# Altium project Ad-Flier.PrjPcb
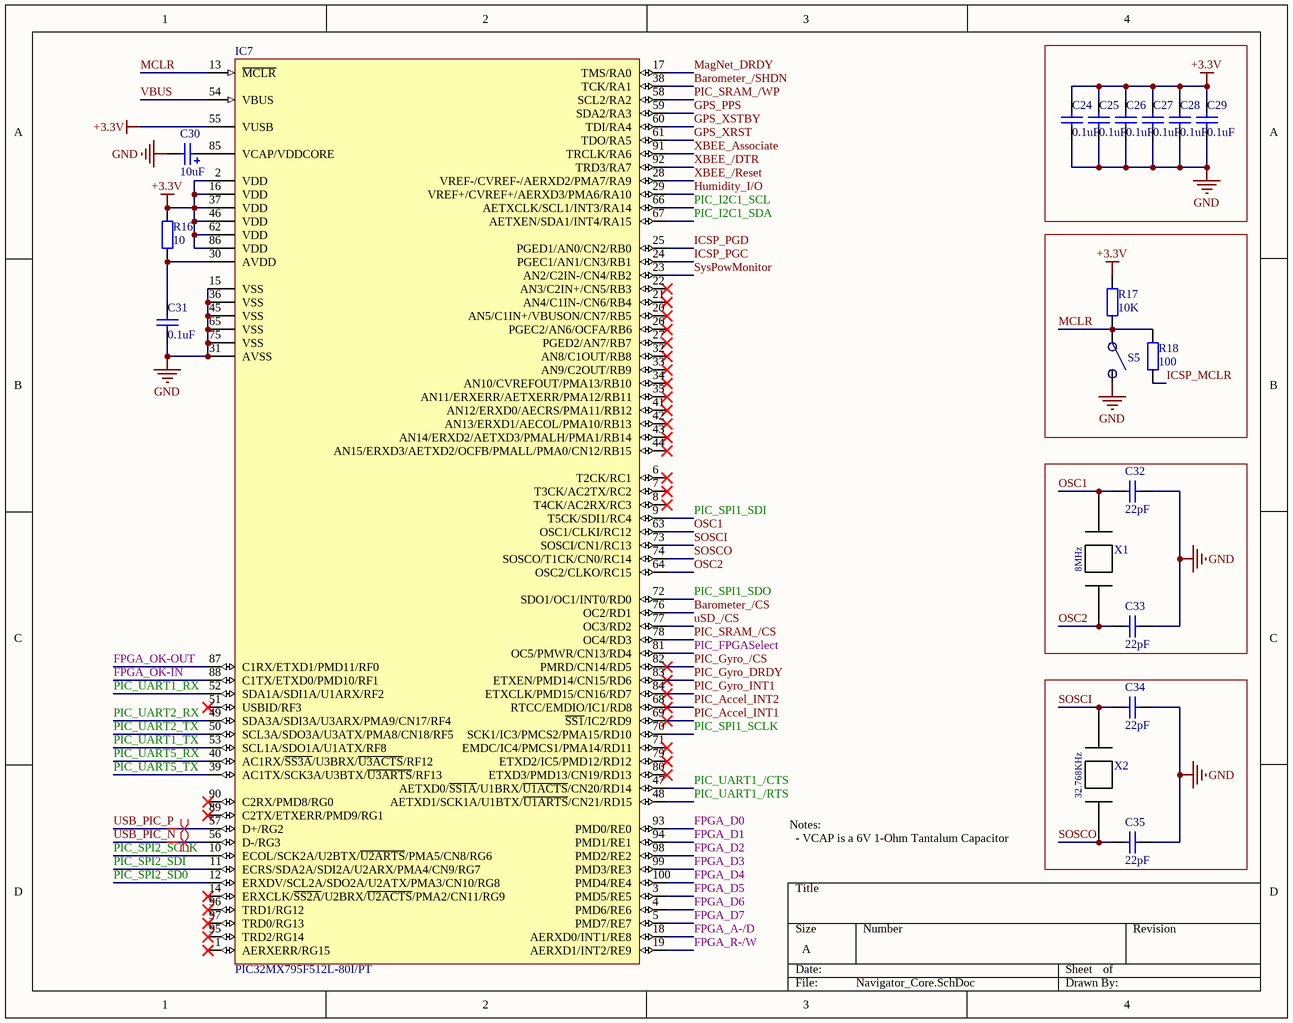
[diagram p0: Navigator_Core.SchDoc]
7 sheets, 156 parts. Net scope: global (net labels, ports and power ports of the same name join across sheets).
Board files: FlightController_Top_5x5.PcbDoc, FlightController_Top_6x6.PcbDoc
Sheets:
  Navigator_Core.SchDoc
  Navigator_Connectors.SchDoc
  Navigator_Components.SchDoc
  FPGA_Core.SchDoc
  FPGA_Clocks.SchDoc
  FPGA_Components.SchDoc
  Power.SchDoc

## Sheet Navigator_Core.SchDoc: The Ad-Flier - Navigation Processor Core
size A; DrawnBy: David J. Greene; Engineer: David J. Greene; DocumentNumber: 2; SheetNumber: 2; SheetTotal: 8; DocumentName: Navigator Processor Core; ProjectName: The Ad-Flier

### Parts
C24  value 0.1uF  [SMD 1206]  (hidden comment: 0.1uF SMD 1206)
C25  value 0.1uF  [SMD 1206]  (hidden comment: 0.1uF SMD 1206)
C26  value 0.1uF  [SMD 1206]  (hidden comment: 0.1uF SMD 1206)
C27  value 0.1uF  [SMD 1206]  (hidden comment: 0.1uF SMD 1206)
C28  value 0.1uF  [SMD 1206]  (hidden comment: 0.1uF SMD 1206)
C29  value 0.1uF  [SMD 1206]  (hidden comment: 0.1uF SMD 1206)
C30  value 10uF  [Capacitor - Tantalum Case A]  (hidden comment: 10uF Low-ESR Tantalum CaseA)
C31  value 0.1uF  [SMD 1206]  (hidden comment: 0.1uF SMD 1206)
C32  value 22pF  [SMD 1206]  (hidden comment: 22pF SMD 1206)
C33  value 22pF  [SMD 1206]  (hidden comment: 22pF SMD 1206)
C34  value 22pF  [SMD 1206]  (hidden comment: 22pF SMD 1206)
C35  value 22pF  [SMD 1206]  (hidden comment: 22pF SMD 1206)
IC7  PIC32MX795F512L-80I/PT  [TQFP-PF100_L]
R16  value 10  [SMD 0805]  (hidden comment: 10 SMD 0805)
R17  value 10K  [SMD 0805]  (hidden comment: 10K SMD 0805)
R18  value 100  [SMD 0805]  (hidden comment: 100 SMD 0805)
S5  SMD Tactile Switch  [SMD Tactile Switch]  (value not drawn)
X1  XT9M20ANA8M  [XT9M20ANA8M - 8MHz Capacitor]  (value not drawn)
X2  SSP-T6-7PF-20PPM  [32.768KHz Crystal]  (value not drawn)

### Nets
+3.3V: C24.1 C25.1 C26.1 C27.1 C28.1 C29.1 IC7.2(VDD) IC7.16(VDD) IC7.37(VDD) IC7.46(VDD) IC7.55(VUSB) IC7.62(VDD) IC7.86(VDD) R16.2 R17.2
GND: C24.2 C25.2 C26.2 C27.2 C28.2 C29.2 C30.2(-) C31.2 C32.1 C33.1 C34.1 C35.1 IC7.15(VSS) IC7.31(AVSS) IC7.36(VSS) IC7.45(VSS) IC7.65(VSS) IC7.75(VSS) S5.1
Barometer_/CS: IC7.76(OC2/RD1)
Barometer_/SHDN: IC7.38(TCK/RA1)
FPGA_A-/D: IC7.18(AERXD0/INT1/RE8)
FPGA_D0: IC7.93(PMD0/RE0)
FPGA_D1: IC7.94(PMD1/RE1)
FPGA_D2: IC7.98(PMD2/RE2)
FPGA_D3: IC7.99(PMD3/RE3)
FPGA_D4: IC7.100(PMD4/RE4)
FPGA_D5: IC7.3(PMD5/RE5)
FPGA_D6: IC7.4(PMD6/RE6)
FPGA_D7: IC7.5(PMD7/RE7)
FPGA_OK-IN: IC7.88(C1TX/ETXD0/PMD10/RF1)
FPGA_OK-OUT: IC7.87(C1RX/ETXD1/PMD11/RF0)
FPGA_R-/W: IC7.19(AERXD1/INT2/RE9)
GPS_PPS: IC7.59(SDA2/RA3)
GPS_XRST: IC7.61(TDO/RA5)
GPS_XSTBY: IC7.60(TDI/RA4)
Humidity_I/O: IC7.29(VREF+/CVREF+/AERXD3/PMA6/RA10)
ICSP_MCLR: R18.2
ICSP_PGC: IC7.24(PGEC1/AN1/CN3/RB1)
ICSP_PGD: IC7.25(PGED1/AN0/CN2/RB0)
MagNet_DRDY: IC7.17(TMS/RA0)
MCLR: IC7.13(~{MCLR}) R17.1 R18.1 S5.2
OSC1: C32.2 IC7.63(OSC1/CLKI/RC12) X1.1
OSC2: C33.2 IC7.64(OSC2/CLKO/RC15) X1.0
PIC_Accel_INT1: IC7.69(~{SS1}/IC2/RD9)
PIC_Accel_INT2: IC7.68(RTCC/EMDIO/IC1/RD8)
PIC_FPGASelect: IC7.81(OC5/PMWR/CN13/RD4)  [project net P135]
PIC_Gyro_/CS: IC7.82(PMRD/CN14/RD5)
PIC_Gyro_DRDY: IC7.83(ETXEN/PMD14/CN15/RD6)
PIC_Gyro_INT1: IC7.84(ETXCLK/PMD15/CN16/RD7)
PIC_I2C1_SCL: IC7.66(AETXCLK/SCL1/INT3/RA14)  [project net DS1085_SCL]
PIC_I2C1_SDA: IC7.67(AETXEN/SDA1/INT4/RA15)  [project net DS1085_SDA]
PIC_SPI1_SCLK: IC7.70(SCK1/IC3/PMCS2/PMA15/RD10)  [project net Barometer_SCLK]
PIC_SPI1_SDI: IC7.9(T5CK/SDI1/RC4)  [project net Barometer_DOUT]
PIC_SPI1_SDO: IC7.72(SDO1/OC1/INT0/RD0)  [project net Barometer_DIN]
PIC_SPI2_SCLK: IC7.10(ECOL/SCK2A/U2BTX/~{U2ARTS}/PMA5/CN8/RG6)  [project net P132]
PIC_SPI2_SD0: IC7.12(ERXDV/SCL2A/SDO2A/U2ATX/PMA3/CN10/RG8)  [project net P133]
PIC_SPI2_SDI: IC7.11(ECRS/SDA2A/SDI2A/U2ARX/PMA4/CN9/RG7)  [project net P134]
PIC_SRAM_/CS: IC7.78(OC4/RD3)
PIC_SRAM_/WP: IC7.58(SCL2/RA2)
PIC_UART1_/CTS: IC7.47(AETXD0/~{SS1A}/U1BRX/~{U1ACTS}/CN20/RD14)
PIC_UART1_/RTS: IC7.48(AETXD1/SCK1A/U1BTX/~{U1ARTS}/CN21/RD15)
PIC_UART1_RX: IC7.52(SDA1A/SDI1A/U1ARX/RF2)
PIC_UART1_TX: IC7.53(SCL1A/SDO1A/U1ATX/RF8)
PIC_UART2_RX: IC7.49(SDA3A/SDI3A/U3ARX/PMA9/CN17/RF4)  [project net GPS_TXB]
PIC_UART2_TX: IC7.50(SCL3A/SDO3A/U3ATX/PMA8/CN18/RF5)  [project net GPS_RXB]
PIC_UART5_RX: IC7.40(AC1RX/~{SS3A}/U3BRX/~{U3ACTS}/RF12)  [project net GPS_TXA]
PIC_UART5_TX: IC7.39(AC1TX/SCK3A/U3BTX/~{U3ARTS}/RF13)  [project net GPS_RXA]
SOSCI: C34.2 IC7.73(SOSCI/CN1/RC13) X2.0
SOSCO: C35.2 IC7.74(SOSCO/T1CK/CN0/RC14) X2.1
SysPowMonitor: IC7.23(AN2/C2IN-/CN4/RB2)
USB_PIC_N: IC7.56(D-/RG3)
USB_PIC_P: IC7.57(D+/RG2)
uSD_/CS: IC7.77(OC3/RD2)
VBUS: IC7.54(VBUS)
XBEE_/DTR: IC7.92(TRD3/RA7)
XBEE_/Reset: IC7.28(VREF-/CVREF-/AERXD2/PMA7/RA9)
XBEE_Associate: IC7.91(TRCLK/RA6)
NetC30_1: C30.1(+) IC7.85(VCAP/VDDCORE)
NetC31_1: C31.1 IC7.30(AVDD) R16.1

Not connected (* = marked no-connect by the designer): IC7 1(AERXERR/RG15)* 6(T2CK/RC1)* 7(T3CK/AC2TX/RC2)* 8(T4CK/AC2RX/RC3)* 14(ERXCLK/~{SS2A}/U2BRX/~{U2ACTS}/PMA2/CN11/RG9)* 20(AN5/C1IN+/VBUSON/CN7/RB5)* 21(AN4/C1IN-/CN6/RB4)* 22(AN3/C2IN+/CN5/RB3)* 26(PGEC2/AN6/OCFA/RB6)* 27(PGED2/AN7/RB7)* 32(AN8/C1OUT/RB8)* 33(AN9/C2OUT/RB9)* 34(AN10/CVREFOUT/PMA13/RB10)* 35(AN11/ERXERR/AETXERR/PMA12/RB11)* 41(AN12/ERXD0/AECRS/PMA11/RB12)* 42(AN13/ERXD1/AECOL/PMA10/RB13)* 43(AN14/ERXD2/AETXD3/PMALH/PMA1/RB14)* 44(AN15/ERXD3/AETXD2/OCFB/PMALL/PMA0/CN12/RB15)* 51(USBID/RF3)* 71(EMDC/IC4/PMCS1/PMA14/RD11)* 79(ETXD2/IC5/PMD12/RD12)* 80(ETXD3/PMD13/CN19/RD13)* 89(C2TX/ETXERR/PMD9/RG1)* 90(C2RX/PMD8/RG0)* 95(TRD2/RG14)* 96(TRD1/RG12)* 97(TRD0/RG13)*

### Layout directives
differential pair: USB_PIC_N, USB_PIC_P

### Notes on the sheet
- Notes:
  - VCAP is a 6V 1-Ohm Tantalum Capacitor
- (in symbol SSP-T6-7PF-20PPM) 32.768KHz
- (in symbol XT9M20ANA8M) 8MHz

### Library data of the parts
C24-C29 C31-C35 = Cap: Capacitor
C30 = SMD_Cap_Tantalum: Tantalum Capacitor - Case A
IC7 = PIC32MX795F512L-80I/PT: High Performance 80 MHz MIPS-Based 32-Bit Flash Microcontroller with USB, CAN and Ethernet, 512KB Program Memory, 100-pin TQFP, Industrial Temperature; Published: 2-Dec-2009; DatasheetVersion: revB, Nov-2009; PackageVersion: revBB, Aug-2009; PackageReference: TQFP-PT100; Publisher: Altium Limited; PackageDescription: 100-Lead Plastic Thin Quad Flatpack (PT) - 12x12x1mm Body, 2.00mm [TQFP]; Supplier 1: Digi-Key; Supplier Part Number 1: PIC32MX795F512L-80I/PT-ND; Supplier 2: Farnell; Supplier Part Number 2: 1778492; ComponentLink1Description: Datasheet; ComponentLink1URL: http://ww1.microchip.com/downloads/en/DeviceDoc/DS-61156B.pdf; ComponentLink2Description: Packaging Specification; ComponentLink2URL: http://ww1.microchip.com/downloads/en/PackagingSpec/en012702.pdf; ComponentLink3Description: Microchip.com Home; ComponentLink3URL: http://www.microchip.com/
R16-R18 = Res2: Resistor
X1 = XT9M20ANA8M: 8MHz SMD Crystal; pin to pad: 0>1 1>2
X2 = SSP-T6-7PF-20PPM: 32.768KHz 7pF SMD Crystal; pin to pad: 0>1 1>2

## Sheet Navigator_Connectors.SchDoc
size A; DocumentNumber: 3; SheetNumber: 3; SheetTotal: 8; PageSetup: Record=PageOptions|CenterHorizontal=True|CenterVertical=True|PrintScale=1.12|XCorrection=1.00|YCorrection=1.00|PrintKind=0|BorderSize=5000000|LeftOffset=0|BottomOffset=0|Orientation=2|PaperLength=1000|PaperWidth=1000|Scale=100|PaperSource=7|PrintQuality=-4|MediaType=1|DitherType=10|PaperKind=Letter|PrintScaleMode=1
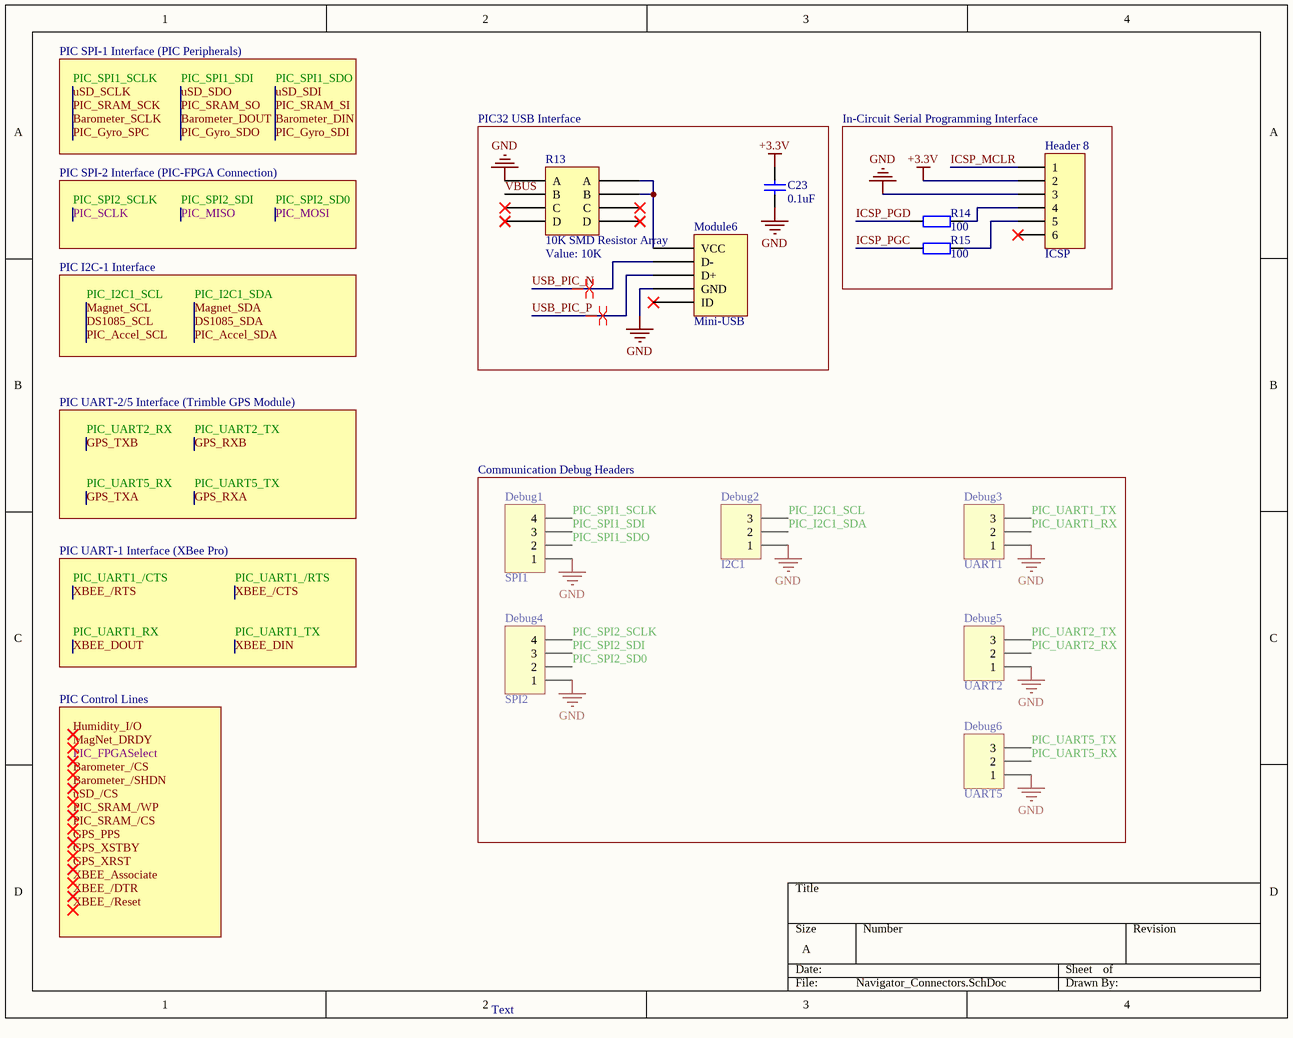
[diagram p1: Navigator_Connectors.SchDoc]

### Parts
C23  value 0.1uF  [SMD 1206]  (hidden comment: 0.1uF SMD 1206)
Debug1  SPI1  [HDR1X4]
Debug2  I2C1  [HDR1X3]
Debug3  UART1  [HDR1X3]
Debug4  SPI2  [HDR1X4]
Debug5  UART2  [HDR1X3]
Debug6  UART5  [HDR1X3]
Header_8  ICSP  [HDR1X6H]
Module6  Mini-USB  [Mini B USB Connector]
R13  10K SMD Resistor Array  value 10K  [Resistor Array YC164]
R14  value 100  [SMD 0805]  (hidden comment: 100 SMD 0805)
R15  value 100  [SMD 0805]  (hidden comment: 100 SMD 0805)

### Blocks framed on the sheet
PIC32 USB Interface: C23 Module6 R13
In-Circuit Serial Programming Interface: Header_8 R14 R15
Communication Debug Headers: Debug1-Debug6

### Nets
+3.3V: C23.2 Header_8.2
GND: C23.1 Debug1.1 Debug2.1 Debug3.1 Debug4.1 Debug5.1 Debug6.1 Header_8.3 Module6.0(GND) R13.5(A)
Barometer_DIN: Debug1.2  [also labelled PIC_Gyro_SDI, PIC_SPI1_SDO, PIC_SRAM_SI, uSD_SDI]
Barometer_DOUT: Debug1.3  [also labelled PIC_Gyro_SDO, PIC_SPI1_SDI, PIC_SRAM_SO, uSD_SDO]
Barometer_SCLK: Debug1.4  [also labelled PIC_Gyro_SPC, PIC_SPI1_SCLK, PIC_SRAM_SCK, uSD_SCLK]
DS1085_SCL: Debug2.3  [also labelled Magnet_SCL, PIC_Accel_SCL, PIC_I2C1_SCL]
DS1085_SDA: Debug2.2  [also labelled Magnet_SDA, PIC_Accel_SDA, PIC_I2C1_SDA]
GPS_RXA: Debug6.3  [also labelled PIC_UART5_TX]
GPS_RXB: Debug5.3  [also labelled PIC_UART2_TX]
GPS_TXA: Debug6.2  [also labelled PIC_UART5_RX]
GPS_TXB: Debug5.2  [also labelled PIC_UART2_RX]
ICSP_MCLR: Header_8.1
ICSP_PGC: R15.2
ICSP_PGD: R14.2
PIC_MISO: Debug4.3  [also labelled PIC_SPI2_SDI]  [project net P134]
PIC_MOSI: Debug4.2  [also labelled PIC_SPI2_SD0]  [project net P133]
PIC_SCLK: Debug4.4  [also labelled PIC_SPI2_SCLK]  [project net P132]
PIC_UART1_RX: Debug3.2  [also labelled XBEE_DOUT]
PIC_UART1_TX: Debug3.3  [also labelled XBEE_DIN]
USB_PIC_N: Module6.3(D-)
USB_PIC_P: Module6.2(D+)
VBUS: R13.6(B)
NetHeader_8_4: Header_8.4 R14.1
NetHeader_8_5: Header_8.5 R15.1
NetModule6_4: Module6.4(VCC) R13.1(A) R13.2(B)

Not connected (* = marked no-connect by the designer): Header_8 6*; Module6 1(ID)*; R13 3(C)* 4(D)* 7(C)* 8(D)*

### Layout directives
differential pair: USB_PIC_N, USB_PIC_P

### Notes on the sheet
- PIC SPI-1 Interface (PIC Peripherals)
- PIC SPI-2 Interface (PIC-FPGA Connection)
- PIC I2C-1 Interface
- PIC UART-2/5 Interface (Trimble GPS Module)
- PIC UART-1 Interface (XBee Pro)
- PIC Control Lines
- Text
- Labels drawn without touching a wire or pin: Barometer_/CS, Barometer_/SHDN, GPS_PPS, GPS_XRST, GPS_XSTBY, Humidity_I/O, MagNet_DRDY, PIC_FPGASelect, PIC_SRAM_/CS, PIC_SRAM_/WP, uSD_/CS, XBEE_/DTR, XBEE_/Reset, XBEE_Associate

### Library data of the parts
C23 = Cap: Capacitor
Debug1 Debug4 = Header 4: Header, 4-Pin; LatestRevisionDate: 17-Jul-2002; LatestRevisionNote: Re-released for DXP Platform.; Publisher: Altium Limited
Debug2 Debug3 Debug5 Debug6 = Header 3: Header, 3-Pin; LatestRevisionDate: 17-Jul-2002; LatestRevisionNote: Re-released for DXP Platform.; Publisher: Altium Limited
Header_8 = Header 6: Header, 6-Pin; LatestRevisionDate: 17-Jul-2002; LatestRevisionNote: Re-released for DXP Platform.; Publisher: Altium Limited
Module6 = Mini USB Connector: pin to pad: 0>1 1>2 2>3 3>4 4>5
R13 = SMD Resistor Array: 4-Count Resistor Array; pin to pad: 5>8 6>7 7>6 8>5
R14 R15 = Res2: Resistor

## Sheet Navigator_Components.SchDoc
size A; DocumentNumber: 4; SheetNumber: 4; SheetTotal: 8; PageSetup: Record=PageOptions|CenterHorizontal=True|CenterVertical=True|PrintScale=1.12|XCorrection=1.00|YCorrection=1.00|PrintKind=0|BorderSize=5000000|LeftOffset=0|BottomOffset=0|Orientation=2|PaperLength=1000|PaperWidth=1000|Scale=100|PaperSource=7|PrintQuality=-4|MediaType=1|DitherType=10|PaperKind=Letter|PrintScaleMode=1
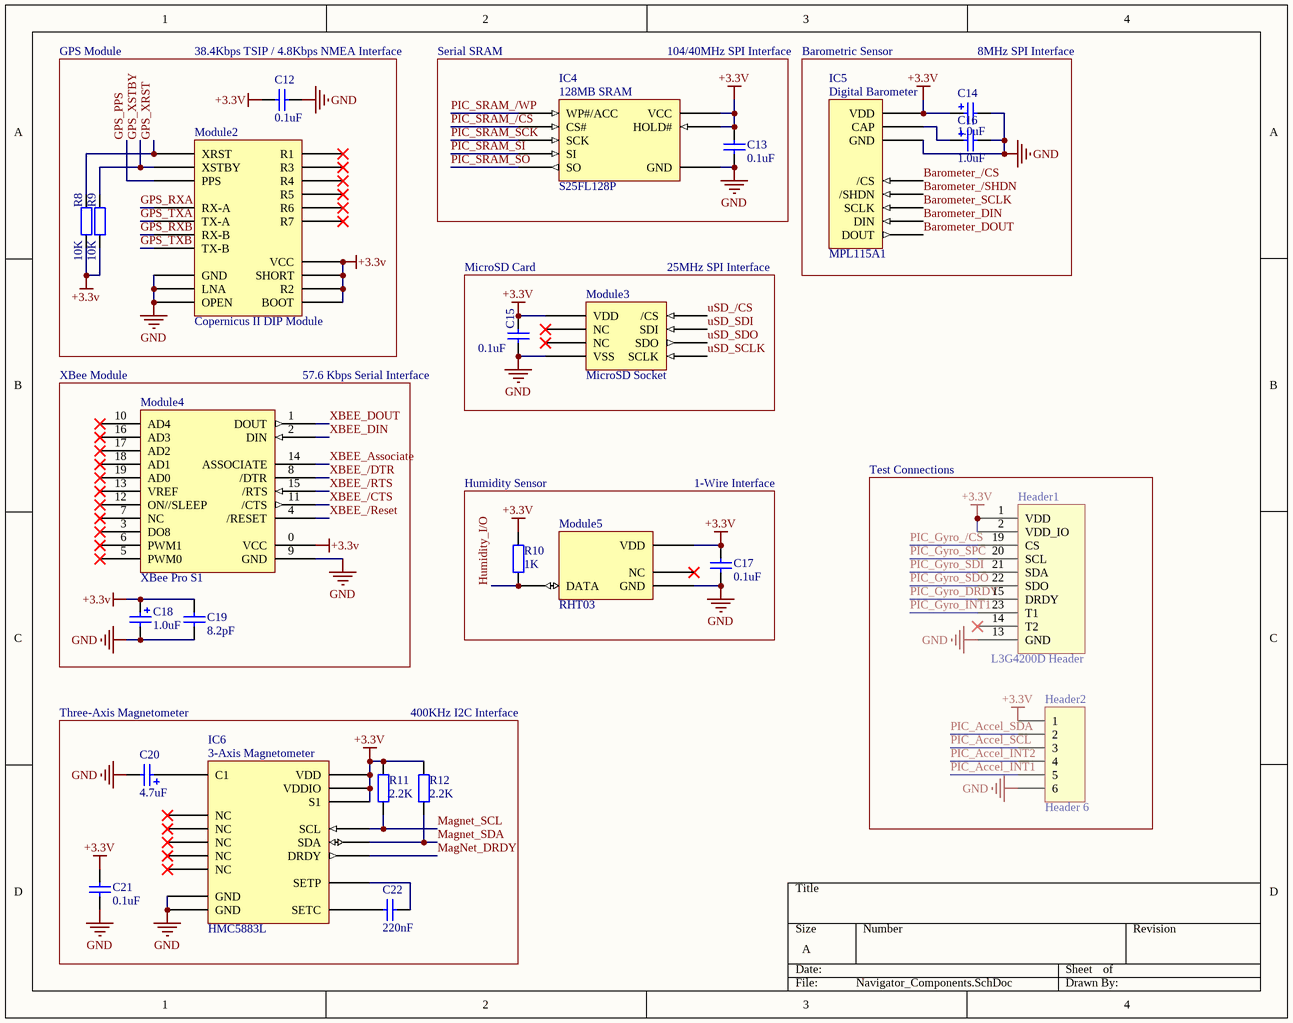
[diagram p2: Navigator_Components.SchDoc]

### Parts
C12  value 0.1uF  [SMD 1206]  (hidden comment: 0.1uF SMD 1206)
C13  value 0.1uF  [SMD 1206]  (hidden comment: 0.1uF SMD 1206)
C14  value 1.0uF  [Capacitor - Tantalum Case A]  (hidden comment: 1.0uF Low-ESR Tantalum CaseA)
C15  value 0.1uF  [SMD 1206]  (hidden comment: 0.1uF SMD 1206)
C16  value 1.0uF  [Capacitor - Tantalum Case A]  (hidden comment: 1.0uF Low-ESR Tantalum CaseA)
C17  value 0.1uF  [SMD 1206]  (hidden comment: 0.1uF SMD 1206)
C18  value 1.0uF  [Capacitor - Tantalum Case A]  (hidden comment: 1.0uF Low-ESR Tantalum CaseA)
C19  value 8.2pF  [SMD 0805]  (hidden comment: 8.2pF SMD 0805)
C20  value 4.7uF  [Capacitor - Tantalum Case A]  (hidden comment: 4.7uF Low-ESR Tantalum CaseA)
C21  value 0.1uF  [SMD 1206]  (hidden comment: 0.1uF SMD 1206)
C22  value 220nF  [SMD 0603]  (hidden comment: 220nF SMD 0603)
Header1  L3G4200D Header  [DIP24]
Header2  Header 6  [HDR1X6]
IC4  S25FL128P  [S25FL128P]
IC5  MPL115A1  [MPL115A1]
IC6  HMC5883L  [HMC5883L-TR]
Module2  Copernicus II DIP Module  [Copernicus GPS Module]
Module3  MicroSD Socket  [MicroSD Card Slot]
Module4  XBee Pro S1  [XBee Pro S1 Wireless Module]
Module5  RHT03  [RHT03 Humidity Sensor]
R8  value 10K  [SMD 0805]  (hidden comment: 10K SMD 0805)
R9  value 10K  [SMD 0805]  (hidden comment: 10K SMD 0805)
R10  value 1K  [SMD 0805]  (hidden comment: 1K SMD 0805)
R11  value 2.2K  [SMD 0805]  (hidden comment: 2.2K SMD 0805)
R12  value 2.2K  [SMD 0805]  (hidden comment: 2.2K SMD 0805)

### Blocks framed on the sheet
Test Connections: Header1 Header2

### Nets
+3.3V: C12.1 C13.1 C14.1(+) C15.2 C17.1 C18.1(+) C19.2 C21.1 Header1.1(VDD) Header1.2(VDD_IO) Header2.1 IC4.6(HOLD#) IC4.7(VCC) IC5.0(VDD) IC6.1(VDD) IC6.3(S1) IC6.12(VDDIO) Module2.3(SHORT) Module2.4(R2) Module2.5(BOOT) Module2.7(VCC) Module3.3(VDD) Module4.0(VCC) Module5.0(VDD) R8.1 R9.1 R10.2 R11.2 R12.2
GND: C12.2 C13.2 C14.2(-) C15.1 C16.2(-) C17.2 C18.2(-) C19.1 C20.2(-) C21.2 Header1.13(GND) Header2.6 IC4.3(GND) IC5.2(GND) IC6.8(GND) IC6.10(GND) Module2.0(LNA) Module2.2(OPEN) Module2.8(GND) Module3.5(VSS) Module4.9(GND) Module5.3(GND)
Barometer_/CS: IC5.4(/CS)
Barometer_/SHDN: IC5.3(/SHDN)
Barometer_DIN: Header1.21(SDA) IC4.4(SI) IC5.6(DIN) Module3.2(SDI)  [also labelled PIC_Gyro_SDI, PIC_SRAM_SI, uSD_SDI]
Barometer_DOUT: Header1.22(SDO) IC4.1(SO) IC5.5(DOUT) Module3.6(SDO)  [also labelled PIC_Gyro_SDO, PIC_SRAM_SO, uSD_SDO]
Barometer_SCLK: Header1.20(SCL) IC4.5(SCK) IC5.7(SCLK) Module3.4(SCLK)  [also labelled PIC_Gyro_SPC, PIC_SRAM_SCK, uSD_SCLK]
GPS_PPS: Module2.12(PPS)
GPS_RXA: Module2.14(RX-A)
GPS_RXB: Module2.13(RX-B)
GPS_TXA: Module2.16(TX-A)
GPS_TXB: Module2.17(TX-B)
GPS_XRST: Module2.6(XRST) R8.2
GPS_XSTBY: Module2.9(XSTBY) R9.2
Humidity_I/O: Module5.1(DATA) R10.1
MagNet_DRDY: IC6.14(DRDY)
Magnet_SCL: Header2.3 IC6.0(SCL) R11.1  [also labelled PIC_Accel_SCL]  [project net DS1085_SCL]
Magnet_SDA: Header2.2 IC6.15(SDA) R12.1  [also labelled PIC_Accel_SDA]  [project net DS1085_SDA]
PIC_Accel_INT1: Header2.5
PIC_Accel_INT2: Header2.4
PIC_Gyro_/CS: Header1.19(CS)
PIC_Gyro_DRDY: Header1.15(DRDY)
PIC_Gyro_INT1: Header1.23(T1)
PIC_SRAM_/CS: IC4.0(CS#)
PIC_SRAM_/WP: IC4.2(WP#/ACC)
uSD_/CS: Module3.1(/CS)
XBEE_/CTS: Module4.11(/CTS)  [project net PIC_UART1_/RTS]
XBEE_/DTR: Module4.8(/DTR)
XBEE_/Reset: Module4.4(/RESET)
XBEE_/RTS: Module4.15(/RTS)  [project net PIC_UART1_/CTS]
XBEE_Associate: Module4.14(ASSOCIATE)
XBEE_DIN: Module4.2(DIN)  [project net PIC_UART1_TX]
XBEE_DOUT: Module4.1(DOUT)  [project net PIC_UART1_RX]
NetC16_1: C16.1(+) IC5.1(CAP)
NetC20_1: C20.1(+) IC6.9(C1)
NetC22_1: C22.1 IC6.11(SETC)
NetC22_2: C22.2 IC6.7(SETP)

Not connected (* = marked no-connect by the designer): Header1 3(1) 4(2) 5(3) 6(4) 7(5) 8(6) 9(7) 10(8) 11(9) 12(10) 14(T2)* 16(11) 17(12) 18(13) 24(14); IC6 2(NC)* 4(NC)* 5(NC)* 6(NC)* 13(NC)*; Module2 1(R1)* 10(R3)* 11(R4)* 15(R5)* 18(R6)* 19(R7)*; Module3 0(NC)* 7(NC)*; Module4 3(DO8)* 5(PWM0)* 6(PWM1)* 7(NC)* 10(AD4)* 12(ON//SLEEP)* 13(VREF)* 16(AD3)* 17(AD2)* 18(AD1)* 19(AD0)*; Module5 2(NC)*

### Notes on the sheet
- GPS Module
- (near C12) 38.4Kbps TSIP / 4.8Kbps NMEA Interface
- Serial SRAM
- 104/40MHz SPI Interface
- Barometric Sensor
- 8MHz SPI Interface
- MicroSD Card
- (near Module3) 25MHz SPI Interface
- (near Module4) XBee Module
- 57.6 Kbps Serial Interface
- Humidity Sensor
- 1-Wire Interface
- Three-Axis Magnetometer
- 400KHz I2C Interface
- (in symbol HMC5883L) 3-Axis Magnetometer
- (in symbol MPL115A1) Digital Barometer
- (in symbol S25FL128P) 128MB SRAM

### Library data of the parts
C12 C13 C15 C17 C19 C21 C22 = Cap: Capacitor
C14 C16 C18 C20 = SMD_Cap_Tantalum: Tantalum Capacitor - Case A
Header2 = Header 6: Header, 6-Pin; LatestRevisionDate: 17-Jul-2002; LatestRevisionNote: Re-released for DXP Platform.; Publisher: Altium Limited
IC4 = S25FL128P: 128MB 104-MHz SPI Flash Memory; pin to pad: 0>1 1>2 2>3 3>4 4>5 5>6 6>7 7>8
IC5 = MPL115A1: Miniature SPI Digital Barometer; pin to pad: 0>1 1>2 2>3 3>4 4>5 5>6 6>7 7>8
IC6 = HMC5883L: 3-Axis Digital Compass IC; pin to pad: 0>1 1>2 2>3 3>4 4>5 5>6 6>7 7>8 8>9 9>10 10>11 11>12 12>13 13>14 14>15 15>16
Module2 = Copernicus II DIP Module: pin to pad: 0>1 1>2 2>3 3>4 4>5 5>6 6>7 7>8 8>9 9>10 10>11 11>12 12>13 13>14 14>15 15>16 16>17 17>18 18>19 19>20
Module3 = MicroSD Socket: MicroSD SPI Interface; pin to pad: 0>1 1>2 2>3 3>4 4>5 5>6 6>7 7>8; Supplier 1: Digi-Key
Module4 = XBee Pro S1: XBee Pro S1 60mW Wireless Module; pin to pad: 0>1 1>2 2>3 3>4 4>5 5>6 6>7 7>8 8>9 9>10 10>11 11>12 12>13 13>14 14>15 15>16 16>17 17>18 18>19 19>20
Module5 = RHT03: Digital Humidity & Temp Sensor; pin to pad: 0>1 1>2 2>3 3>4
R8-R12 = Res2: Resistor

## Sheet FPGA_Core.SchDoc
size A; DocumentNumber: 5; SheetNumber: 5; SheetTotal: 8; PageSetup: Record=PageOptions|CenterHorizontal=True|CenterVertical=True|PrintScale=1.12|XCorrection=1.00|YCorrection=1.00|PrintKind=0|BorderSize=5000000|LeftOffset=0|BottomOffset=0|Orientation=2|PaperLength=1000|PaperWidth=1000|Scale=100|PaperSource=7|PrintQuality=-4|MediaType=1|DitherType=10|PaperKind=Letter|PrintScaleMode=1
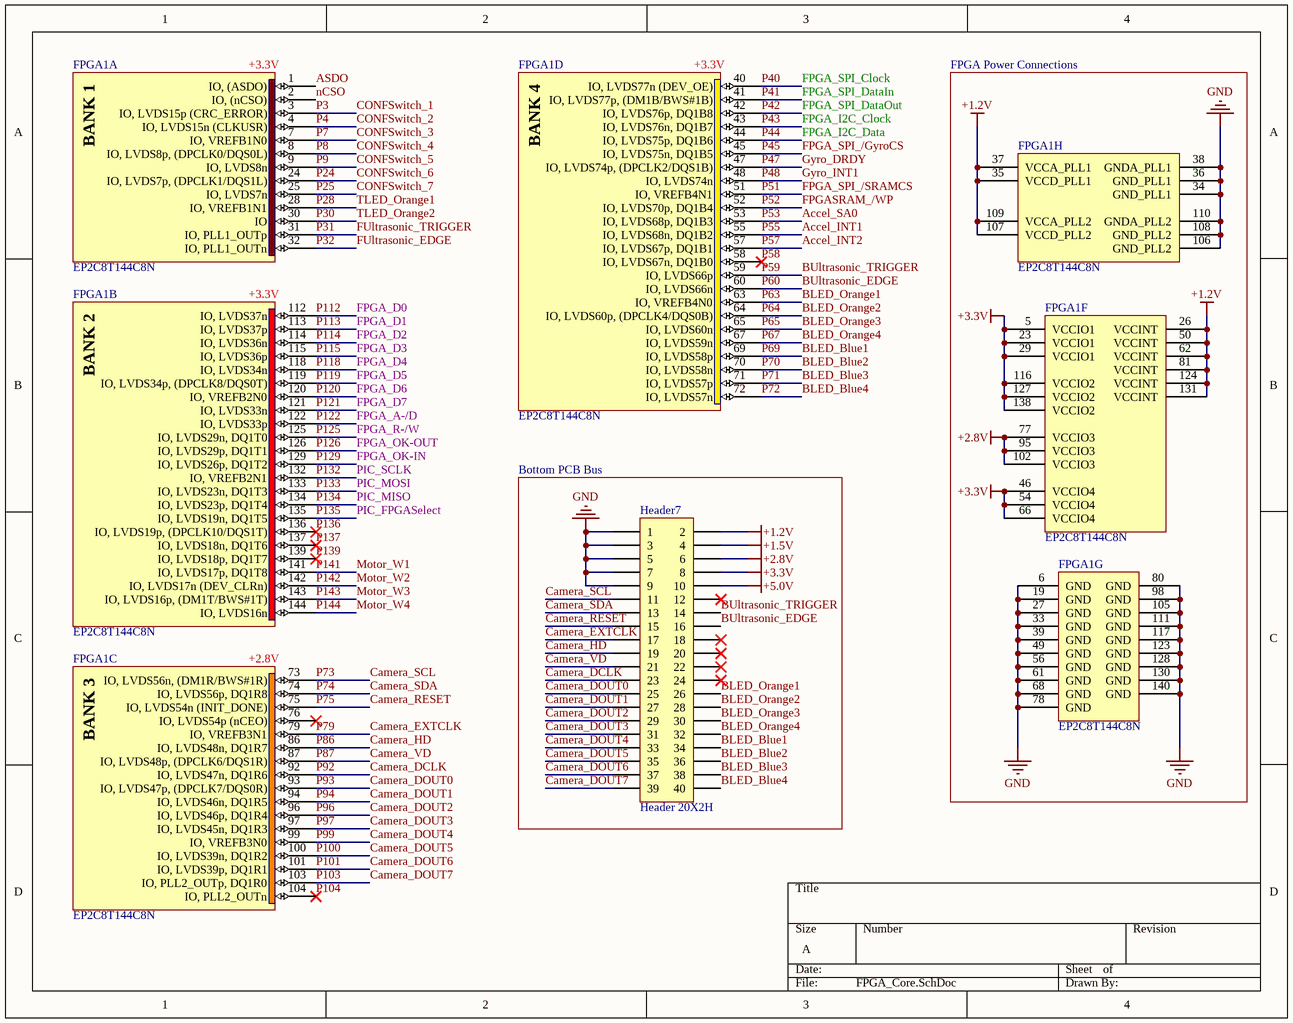
[diagram p3: FPGA_Core.SchDoc]

### Parts
FPGA1  EP2C8T144C8N  [TQFP144_N]  (parts A,B,C,D,F,G,H of 9)
Header7  Header 20X2H  [HDR2X20]

### Blocks framed on the sheet
FPGA Power Connections: FPGA1
Bottom PCB Bus: Header7

### Nets
+1.2V: FPGA1.26(VCCINT) FPGA1.35(VCCD_PLL1) FPGA1.37(VCCA_PLL1) FPGA1.50(VCCINT) FPGA1.62(VCCINT) FPGA1.81(VCCINT) FPGA1.107(VCCD_PLL2) FPGA1.109(VCCA_PLL2) FPGA1.124(VCCINT) FPGA1.131(VCCINT) Header7.2
+1.5V: Header7.4
+2.8V: FPGA1.77(VCCIO3) FPGA1.95(VCCIO3) FPGA1.102(VCCIO3) Header7.6
+3.3V: FPGA1.5(VCCIO1) FPGA1.23(VCCIO1) FPGA1.29(VCCIO1) FPGA1.46(VCCIO4) FPGA1.54(VCCIO4) FPGA1.66(VCCIO4) FPGA1.116(VCCIO2) FPGA1.127(VCCIO2) FPGA1.138(VCCIO2) Header7.8
+5.0V: Header7.10
GND: FPGA1.6(GND) FPGA1.19(GND) FPGA1.27(GND) FPGA1.33(GND) FPGA1.34(GND_PLL1) FPGA1.36(GND_PLL1) FPGA1.38(GNDA_PLL1) FPGA1.39(GND) FPGA1.49(GND) FPGA1.56(GND) FPGA1.61(GND) FPGA1.68(GND) FPGA1.78(GND) FPGA1.80(GND) FPGA1.98(GND) FPGA1.105(GND) FPGA1.106(GND_PLL2) FPGA1.108(GND_PLL2) FPGA1.110(GNDA_PLL2) FPGA1.111(GND) FPGA1.117(GND) FPGA1.123(GND) FPGA1.128(GND) FPGA1.130(GND) FPGA1.140(GND) Header7.1 Header7.3 Header7.5 Header7.7 Header7.9
Accel_INT1: FPGA1.55(IO,_LVDS68n,_DQ1B2)  [also labelled P55]
Accel_INT2: FPGA1.57(IO,_LVDS67p,_DQ1B1)  [also labelled P57]
Accel_SA0: FPGA1.53(IO,_LVDS68p,_DQ1B3)  [also labelled P53]
ASDO: FPGA1.1(IO,_(ASDO))
BLED_Blue1: FPGA1.69(IO,_LVDS58p) Header7.34  [also labelled P69]
BLED_Blue2: FPGA1.70(IO,_LVDS58n) Header7.36  [also labelled P70]
BLED_Blue3: FPGA1.71(IO,_LVDS57p) Header7.38  [also labelled P71]
BLED_Blue4: FPGA1.72(IO,_LVDS57n) Header7.40  [also labelled P72]
BLED_Orange1: FPGA1.63(IO,_VREFB4N0) Header7.26  [also labelled P63]
BLED_Orange2: FPGA1.64(IO,_LVDS60p,_(DPCLK4/DQS0B)) Header7.28  [also labelled P64]
BLED_Orange3: FPGA1.65(IO,_LVDS60n) Header7.30  [also labelled P65]
BLED_Orange4: FPGA1.67(IO,_LVDS59n) Header7.32  [also labelled P67]
BUltrasonic_EDGE: FPGA1.60(IO,_LVDS66n) Header7.16  [also labelled P60]
BUltrasonic_TRIGGER: FPGA1.59(IO,_LVDS66p) Header7.14  [also labelled P59]
Camera_DCLK: FPGA1.92(IO,_LVDS47n,_DQ1R6) Header7.23  [also labelled P92]
Camera_DOUT0: FPGA1.93(IO,_LVDS47p,_(DPCLK7/DQS0R)) Header7.25  [also labelled P93]
Camera_DOUT1: FPGA1.94(IO,_LVDS46n,_DQ1R5) Header7.27  [also labelled P94]
Camera_DOUT2: FPGA1.96(IO,_LVDS46p,_DQ1R4) Header7.29  [also labelled P96]
Camera_DOUT3: FPGA1.97(IO,_LVDS45n,_DQ1R3) Header7.31  [also labelled P97]
Camera_DOUT4: FPGA1.99(IO,_VREFB3N0) Header7.33  [also labelled P99]
Camera_DOUT5: FPGA1.100(IO,_LVDS39n,_DQ1R2) Header7.35  [also labelled P100]
Camera_DOUT6: FPGA1.101(IO,_LVDS39p,_DQ1R1) Header7.37  [also labelled P101]
Camera_DOUT7: FPGA1.103(IO,_PLL2_OUTp,_DQ1R0) Header7.39  [also labelled P103]
Camera_EXTCLK: FPGA1.79(IO,_VREFB3N1) Header7.17  [also labelled P79]
Camera_HD: FPGA1.86(IO,_LVDS48n,_DQ1R7) Header7.19  [also labelled P86]
Camera_RESET: FPGA1.75(IO,_LVDS54n_(INIT_DONE)) Header7.15  [also labelled P75]
Camera_SCL: FPGA1.73(IO,_LVDS56n,_(DM1R/BWS#1R)) Header7.11  [also labelled P73]
Camera_SDA: FPGA1.74(IO,_LVDS56p,_DQ1R8) Header7.13  [also labelled P74]
Camera_VD: FPGA1.87(IO,_LVDS48p,_(DPCLK6/DQS1R)) Header7.21  [also labelled P87]
CONFSwitch_1: FPGA1.3(IO,_LVDS15p_(CRC_ERROR))  [also labelled P3]
CONFSwitch_2: FPGA1.4(IO,_LVDS15n_(CLKUSR))  [also labelled P4]
CONFSwitch_3: FPGA1.7(IO,_VREFB1N0)  [also labelled P7]
CONFSwitch_4: FPGA1.8(IO,_LVDS8p,_(DPCLK0/DQS0L))  [also labelled P8]
CONFSwitch_5: FPGA1.9(IO,_LVDS8n)  [also labelled P9]
CONFSwitch_6: FPGA1.24(IO,_LVDS7p,_(DPCLK1/DQS1L))  [also labelled P24]
CONFSwitch_7: FPGA1.25(IO,_LVDS7n)  [also labelled P25]
FPGA_A-/D: FPGA1.122(IO,_LVDS33p)  [also labelled P122]
FPGA_D0: FPGA1.112(IO,_LVDS37n)  [also labelled P112]
FPGA_D1: FPGA1.113(IO,_LVDS37p)  [also labelled P113]
FPGA_D2: FPGA1.114(IO,_LVDS36n)  [also labelled P114]
FPGA_D3: FPGA1.115(IO,_LVDS36p)  [also labelled P115]
FPGA_D4: FPGA1.118(IO,_LVDS34n)  [also labelled P118]
FPGA_D5: FPGA1.119(IO,_LVDS34p,_(DPCLK8/DQS0T))  [also labelled P119]
FPGA_D6: FPGA1.120(IO,_VREFB2N0)  [also labelled P120]
FPGA_D7: FPGA1.121(IO,_LVDS33n)  [also labelled P121]
FPGA_I2C_Clock: FPGA1.43(IO,_LVDS76n,_DQ1B7)  [also labelled P43]  [project net Accel_SCL]
FPGA_I2C_Data: FPGA1.44(IO,_LVDS75p,_DQ1B6)  [also labelled P44]  [project net Accel_SDA]
FPGA_OK-IN: FPGA1.129(IO,_LVDS26p,_DQ1T2)  [also labelled P129]
FPGA_OK-OUT: FPGA1.126(IO,_LVDS29p,_DQ1T1)  [also labelled P126]
FPGA_R-/W: FPGA1.125(IO,_LVDS29n,_DQ1T0)  [also labelled P125]
FPGA_SPI_/GyroCS: FPGA1.45(IO,_LVDS75n,_DQ1B5)  [also labelled P45]
FPGA_SPI_/SRAMCS: FPGA1.51(IO,_VREFB4N1)  [also labelled P51]
FPGA_SPI_Clock: FPGA1.40(IO,_LVDS77n_(DEV_OE))  [also labelled P40]
FPGA_SPI_DataIn: FPGA1.41(IO,_LVDS77p,_(DM1B/BWS#1B))  [also labelled P41]
FPGA_SPI_DataOut: FPGA1.42(IO,_LVDS76p,_DQ1B8)  [also labelled P42]
FPGASRAM_/WP: FPGA1.52(IO,_LVDS70p,_DQ1B4)  [also labelled P52]
FUltrasonic_EDGE: FPGA1.32(IO,_PLL1_OUTn)  [also labelled P32]
FUltrasonic_TRIGGER: FPGA1.31(IO,_PLL1_OUTp)  [also labelled P31]
Gyro_DRDY: FPGA1.47(IO,_LVDS74p,_(DPCLK2/DQS1B))  [also labelled P47]
Gyro_INT1: FPGA1.48(IO,_LVDS74n)  [also labelled P48]
Motor_W1: FPGA1.141(IO,_LVDS17p,_DQ1T8)  [also labelled P141]
Motor_W2: FPGA1.142(IO,_LVDS17n_(DEV_CLRn))  [also labelled P142]
Motor_W3: FPGA1.143(IO,_LVDS16p,_(DM1T/BWS#1T))  [also labelled P143]
Motor_W4: FPGA1.144(IO,_LVDS16n)  [also labelled P144]
nCSO: FPGA1.2(IO,_(nCSO))
P28: FPGA1.28(IO,_VREFB1N1)  [also labelled TLED_Orange1]
P30: FPGA1.30(IO)  [also labelled TLED_Orange2]
P58: FPGA1.58(IO,_LVDS67n,_DQ1B0)
P104: FPGA1.104(IO,_PLL2_OUTn)
P132: FPGA1.132(IO,_VREFB2N1)  [also labelled PIC_SCLK]
P133: FPGA1.133(IO,_LVDS23n,_DQ1T3)  [also labelled PIC_MOSI]
P134: FPGA1.134(IO,_LVDS23p,_DQ1T4)  [also labelled PIC_MISO]
P135: FPGA1.135(IO,_LVDS19n,_DQ1T5)  [also labelled PIC_FPGASelect]
P136: FPGA1.136(IO,_LVDS19p,_(DPCLK10/DQS1T))
P137: FPGA1.137(IO,_LVDS18n,_DQ1T6)
P139: FPGA1.139(IO,_LVDS18p,_DQ1T7)

Not connected (* = marked no-connect by the designer): FPGA1 76(IO,_LVDS54p_(nCEO))*; Header7 12* 18* 20* 22* 24*

### Notes on the sheet
- (near FPGA1) +3.3V
- (near FPGA1) +2.8V
- (in symbol EP2C8T144C8N, part A) BANK 1
- (in symbol EP2C8T144C8N, part B) BANK 2
- (in symbol EP2C8T144C8N, part C) BANK 3
- (in symbol EP2C8T144C8N, part D) BANK 4

### Library data of the parts
FPGA1 = EP2C8T144C8N: Cyclone II Family, 1.2V FPGA, 85 I/O Pins, 2 PLLs, 144-Pin TQFP, Speed Grade 8, Commercial Grade, Pb-Free; Published: 4-Mar-2005; LatestRevisionDate: 14-May-2007; LatestRevisionNote: DATA0 pin is now INPUT.; DatasheetVersion: ver3.3, Feb-2008; PackageVersion: ver15.4, Dec-2008; PackageReference: TQFP144; Publisher: Altium Limited; PackageDescription: 144-Pin Plastic Thin Quad Flat Pack (TQFP144) - Wire Bond; Supplier 1: Digi-Key; Supplier Part Number 1: 544-1666-ND; Supplier 2: Farnell; Supplier Part Number 2: 1453487; Supplier 3: Farnell; Supplier Part Number 3: 1662256; Code_JEDEC: MS-026-BFB; ComponentLink1Description: Manufacturer Link; ComponentLink1URL: http://www.altera.com/products/devices/cyclone2/cy2-index.jsp; ComponentLink2Description: Handbook; ComponentLink2URL: http://www.altera.com/literature/hb/cyc2/cyc2_cii5v1.pdf; ComponentLink3Description: Packaging Specification; ComponentLink3URL: http://www.altera.com/literature/ds/dspkg.pdf
Header7 = Header 20X2H: Header, 20-Pin, Dual row, Right Angle; LatestRevisionDate: 17-Jul-2002; LatestRevisionNote: Re-released for DXP Platform.; Publisher: Altium Limited

## Sheet FPGA_Clocks.SchDoc
size A; DocumentNumber: 6; SheetNumber: 6; SheetTotal: 8; PageSetup: Record=PageOptions|CenterHorizontal=True|CenterVertical=True|PrintScale=1.12|XCorrection=1.00|YCorrection=1.00|PrintKind=0|BorderSize=5000000|LeftOffset=0|BottomOffset=0|Orientation=2|PaperLength=1000|PaperWidth=1000|Scale=100|PaperSource=7|PrintQuality=-4|MediaType=1|DitherType=10|PaperKind=Letter|PrintScaleMode=1
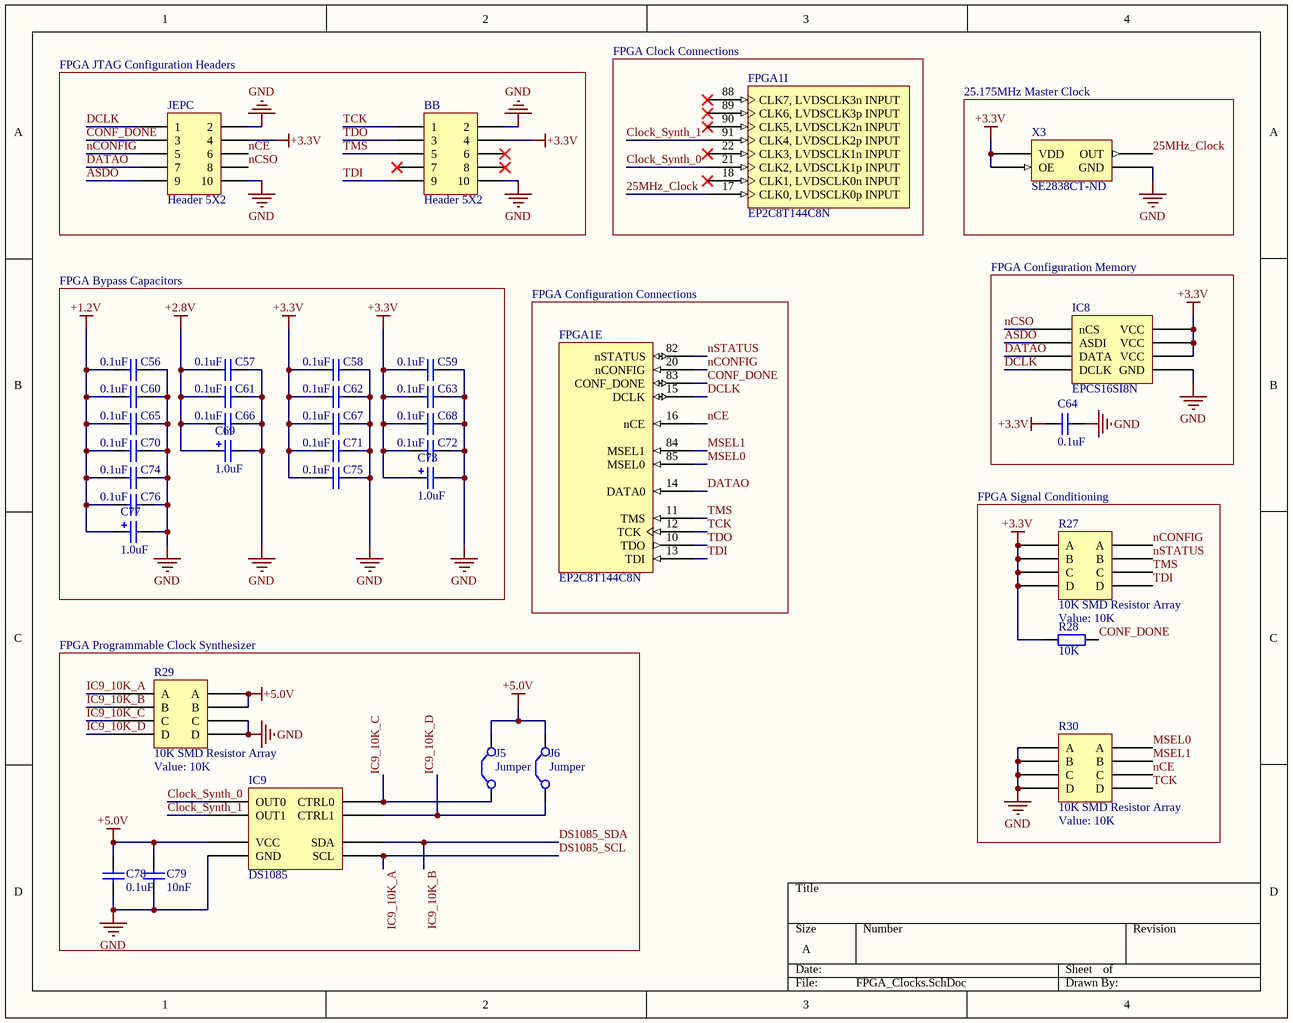
[diagram p4: FPGA_Clocks.SchDoc]

### Parts
BB  Header 5X2  [HDR2X5]
C56  value 0.1uF  [SMD 1206]  (hidden comment: 0.1uF SMD 1206)
C57  value 0.1uF  [SMD 1206]  (hidden comment: 0.1uF SMD 1206)
C58  value 0.1uF  [SMD 1206]  (hidden comment: 0.1uF SMD 1206)
C59  value 0.1uF  [SMD 1206]  (hidden comment: 0.1uF SMD 1206)
C60  value 0.1uF  [SMD 1206]  (hidden comment: 0.1uF SMD 1206)
C61  value 0.1uF  [SMD 1206]  (hidden comment: 0.1uF SMD 1206)
C62  value 0.1uF  [SMD 1206]  (hidden comment: 0.1uF SMD 1206)
C63  value 0.1uF  [SMD 1206]  (hidden comment: 0.1uF SMD 1206)
C64  value 0.1uF  [SMD 1206]  (hidden comment: 0.1uF SMD 1206)
C65  value 0.1uF  [SMD 1206]  (hidden comment: 0.1uF SMD 1206)
C66  value 0.1uF  [SMD 1206]  (hidden comment: 0.1uF SMD 1206)
C67  value 0.1uF  [SMD 1206]  (hidden comment: 0.1uF SMD 1206)
C68  value 0.1uF  [SMD 1206]  (hidden comment: 0.1uF SMD 1206)
C69  value 1.0uF  [Capacitor - Tantalum Case A]  (hidden comment: 1.0uF Low-ESR Tantalum CaseA)
C70  value 0.1uF  [SMD 1206]  (hidden comment: 0.1uF SMD 1206)
C71  value 0.1uF  [SMD 1206]  (hidden comment: 0.1uF SMD 1206)
C72  value 0.1uF  [SMD 1206]  (hidden comment: 0.1uF SMD 1206)
C73  value 1.0uF  [Capacitor - Tantalum Case A]  (hidden comment: 1.0uF Low-ESR Tantalum CaseA)
C74  value 0.1uF  [SMD 1206]  (hidden comment: 0.1uF SMD 1206)
C75  value 0.1uF  [SMD 1206]  (hidden comment: 0.1uF SMD 1206)
C76  value 0.1uF  [SMD 1206]  (hidden comment: 0.1uF SMD 1206)
C77  value 1.0uF  [Capacitor - Tantalum Case A]  (hidden comment: 1.0uF Low-ESR Tantalum CaseA)
C78  value 0.1uF  [SMD 1206]  (hidden comment: 0.1uF SMD 1206)
C79  value 10nF  [SMD 1206]  (hidden comment: 10nF SMD 1206)
FPGA1  EP2C8T144C8N  [TQFP144_N]  (parts E,I of 9)
IC8  EPCS16SI8N  [EPCS16SI8N SO-8]
IC9  DS1085  [DS1085 SO-150mil]
J5  Jumper  [HDR1X2]
J6  Jumper  [HDR1X2]
JEPC  Header 5X2  [HDR2X5]
R27  10K SMD Resistor Array  value 10K  [Resistor Array YC164]
R28  value 10K  [SMD 0805]  (hidden comment: 10K SMD 0805)
R29  10K SMD Resistor Array  value 10K  [Resistor Array YC164]
R30  10K SMD Resistor Array  value 10K  [Resistor Array YC164]
X3  SE2838CT-ND  [SG-636PCE 25.175MHz Crystal]

### Blocks framed on the sheet
FPGA JTAG Configuration Headers: BB JEPC
FPGA Clock Connections: FPGA1
25.175MHz Master Clock: X3
FPGA Bypass Capacitors: C56-C63 C65-C77
FPGA Configuration Memory: C64 IC8
FPGA Configuration Connections: FPGA1
FPGA Signal Conditioning: R27 R28 R30
FPGA Programmable Clock Synthesizer: C78 C79 IC9 J5 J6 R29

### Nets
+1.2V: C56.1 C60.1 C65.1 C70.1 C74.1 C76.1 C77.1(+)
+2.8V: C57.1 C61.1 C66.1 C69.1(+)
+3.3V: BB.4 C58.1 C59.1 C62.1 C63.1 C64.1 C67.1 C68.1 C71.1 C72.1 C73.1(+) C75.1 IC8.2(VCC) IC8.6(VCC) IC8.7(VCC) JEPC.4 R27.5(A) R27.6(B) R27.7(C) R27.8(D) R28.1 X3.0(OE) X3.3(VDD)
+5.0V: C78.2 C79.2 IC9.2(VCC) J5.2(C2) J6.2(C2) R29.1(A) R29.2(B)
GND: BB.2 BB.10 C56.2 C57.2 C58.2 C59.2 C60.2 C61.2 C62.2 C63.2 C64.2 C65.2 C66.2 C67.2 C68.2 C69.2(-) C70.2 C71.2 C72.2 C73.2(-) C74.2 C75.2 C76.2 C77.2(-) C78.1 C79.1 IC8.3(GND) IC9.3(GND) JEPC.2 JEPC.10 R29.3(C) R29.4(D) R30.5(A) R30.6(B) R30.7(C) R30.8(D) X3.1(GND)
25MHz_Clock: FPGA1.17(CLK0,_LVDSCLK0p_INPUT) X3.2(OUT)
ASDO: IC8.4(ASDI) JEPC.9
Clock_Synth_0: FPGA1.21(CLK2,_LVDSCLK1p_INPUT) IC9.1(OUT0)
Clock_Synth_1: FPGA1.91(CLK4,_LVDSCLK2p_INPUT) IC9.0(OUT1)
CONF_DONE: FPGA1.83(CONF_DONE) JEPC.3 R28.2
DATAO: FPGA1.14(DATA0) IC8.1(DATA) JEPC.7
DCLK: FPGA1.15(DCLK) IC8.5(DCLK) JEPC.1
DS1085_SCL: IC9.7(SCL) R29.5(A)  [also labelled IC9_10K_A]
DS1085_SDA: IC9.6(SDA) R29.6(B)  [also labelled IC9_10K_B]
IC9_10K_C: IC9.4(CTRL0) J5.1(C1) R29.7(C)
IC9_10K_D: IC9.5(CTRL1) J6.1(C1) R29.8(D)
MSEL0: FPGA1.85(MSEL0) R30.1(A)
MSEL1: FPGA1.84(MSEL1) R30.2(B)
nCE: FPGA1.16(nCE) JEPC.6 R30.3(C)
nCONFIG: FPGA1.20(nCONFIG) JEPC.5 R27.1(A)
nCSO: IC8.0(nCS) JEPC.8
nSTATUS: FPGA1.82(nSTATUS) R27.2(B)
TCK: BB.1 FPGA1.12(TCK) R30.4(D)
TDI: BB.9 FPGA1.13(TDI) R27.4(D)
TDO: BB.3 FPGA1.10(TDO)
TMS: BB.5 FPGA1.11(TMS) R27.3(C)

Not connected (* = marked no-connect by the designer): BB 6* 7* 8*; FPGA1 18(CLK1,_LVDSCLK0n_INPUT)* 22(CLK3,_LVDSCLK1n_INPUT)* 88(CLK7,_LVDSCLK3n_INPUT)* 89(CLK6,_LVDSCLK3p_INPUT)* 90(CLK5,_LVDSCLK2n_INPUT)*

### Library data of the parts
BB JEPC = Header 5X2: Header, 5-Pin, Dual row; LatestRevisionDate: 17-Jul-2002; LatestRevisionNote: Re-released for DXP Platform.; Publisher: Altium Limited
C56-C68 C70-C72 C74-C76 C78 C79 = Cap: Capacitor
C69 C73 C77 = SMD_Cap_Tantalum: Tantalum Capacitor - Case A
FPGA1 = EP2C8T144C8N: as FPGA1 on sheet FPGA_Core; Published: 4-Mar-2005; LatestRevisionDate: 14-May-2007; LatestRevisionNote: DATA0 pin is now INPUT.; DatasheetVersion: ver3.3, Feb-2008; PackageVersion: ver15.4, Dec-2008; PackageReference: TQFP144; Publisher: Altium Limited; PackageDescription: 144-Pin Plastic Thin Quad Flat Pack (TQFP144) - Wire Bond; Supplier 1: Digi-Key; Supplier Part Number 1: 544-1666-ND; Supplier 2: Farnell; Supplier Part Number 2: 1453487; Supplier 3: Farnell; Supplier Part Number 3: 1662256; Code_JEDEC: MS-026-BFB; ComponentLink1Description: Manufacturer Link; ComponentLink1URL: http://www.altera.com/products/devices/cyclone2/cy2-index.jsp; ComponentLink2Description: Handbook; ComponentLink2URL: http://www.altera.com/literature/hb/cyc2/cyc2_cii5v1.pdf; ComponentLink3Description: Packaging Specification; ComponentLink3URL: http://www.altera.com/literature/ds/dspkg.pdf
IC8 = EPCS16SI8N: 16MB FPGA CONFIGURATION DEVICE; pin to pad: 0>1 1>2 2>3 3>4 4>5 5>6 6>7 7>8
IC9 = DS1085: EconOscillator Frequency Synthesizer; pin to pad: 0>1 1>2 2>3 3>4 4>5 5>6 6>7 7>8
J5 J6 = Jumper: Jumper Wire; Published: 24-Mar-1999; LatestRevisionDate: 17-Jul-2002; LatestRevisionNote: Re-released for DXP Platform.; PackageReference: RAD-0.2; Publisher: Altium Limited; PackageDescription: Radial Cap, Thru-Hole; 2 Leads; 0.2 in Pin Spacing
R27 R29 R30 = SMD Resistor Array: 4-Count Resistor Array; pin to pad: 5>8 6>7 7>6 8>5
R28 = Res2: Resistor
X3 = SE2838CT-ND: OSCILLATOR 25.1750MHZ SMD; pin to pad: 0>1 1>2 2>3 3>4

## Sheet FPGA_Components.SchDoc
size A; DocumentNumber: 7; SheetNumber: 7; SheetTotal: 8; PageSetup: Record=PageOptions|CenterHorizontal=True|CenterVertical=True|PrintScale=1.12|XCorrection=1.00|YCorrection=1.00|PrintKind=0|BorderSize=5000000|LeftOffset=0|BottomOffset=0|Orientation=2|PaperLength=1000|PaperWidth=1000|Scale=100|PaperSource=7|PrintQuality=-4|MediaType=1|DitherType=10|PaperKind=Letter|PrintScaleMode=1
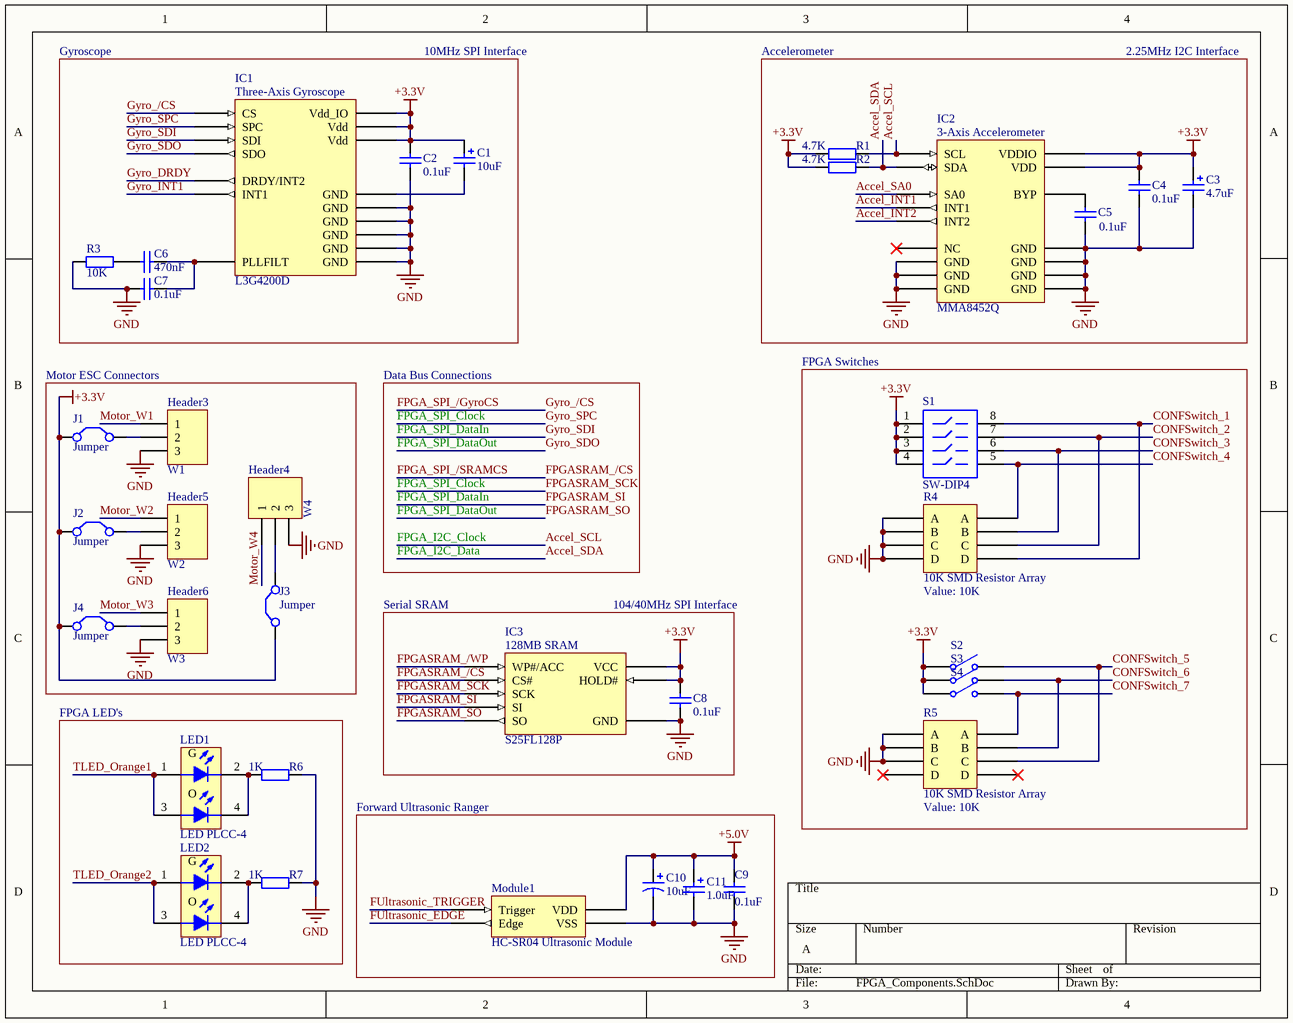
[diagram p5: FPGA_Components.SchDoc]

### Parts
C1  value 10uF  [Capacitor - Tantalum Case A]  (hidden comment: 10uF Low-ESR Tantalum CaseA)
C2  value 0.1uF  [SMD 1206]  (hidden comment: 0.1uF SMD 1206)
C3  value 4.7uF  [Capacitor - Tantalum Case A]  (hidden comment: 4.7uF Low-ESR Tantalum CaseA)
C4  value 0.1uF  [SMD 1206]  (hidden comment: 0.1uF SMD 1206)
C5  value 0.1uF  [SMD 1206]  (hidden comment: 0.1uF SMD 1206)
C6  value 470nF  [SMD 0603]  (hidden comment: 470nF SMD 0603)
C7  value 0.1uF  [SMD 1206]  (hidden comment: 0.1uF SMD 1206)
C8  value 0.1uF  [SMD 1206]  (hidden comment: 0.1uF SMD 1206)
C9  value 0.1uF  [SMD 1206]  (hidden comment: 0.1uF SMD 1206)
C10  value 10uF  [CAPPR2-5x5]  (hidden comment: 10uF Electrolitic)
C11  value 1.0uF  [Capacitor - Tantalum Case A]  (hidden comment: 1.0uF Low-ESR Tantalum CaseA)
Header3  W1  [HDR1X3H]
Header4  W4  [HDR1X3H]
Header5  W2  [HDR1X3H]
Header6  W3  [HDR1X3H]
IC1  L3G4200D  [L3G4200DTR]
IC2  MMA8452Q  [MMA8452QT]
IC3  S25FL128P  [S25FL128P]
J1  Jumper  [HDR1X2]
J2  Jumper  [HDR1X2]
J3  Jumper  [HDR1X2]
J4  Jumper  [HDR1X2]
LED1  LED PLCC-4  [PLCC-4 LED]
LED2  LED PLCC-4  [PLCC-4 LED]
Module1  HC-SR04 Ultrasonic Module  [HC-SR04 Ultrasonic Ranger]
R1  value 4.7K  [SMD 0805]  (hidden comment: 4.7K SMD 0805)
R2  value 4.7K  [SMD 0805]  (hidden comment: 4.7K SMD 0805)
R3  value 10K  [SMD 0805]  (hidden comment: 10K SMD 0805)
R4  10K SMD Resistor Array  value 10K  [Resistor Array YC164]
R5  10K SMD Resistor Array  value 10K  [Resistor Array YC164]
R6  value 1K  [SMD 0805]  (hidden comment: 1K SMD 0805)
R7  value 1K  [SMD 0805]  (hidden comment: 1K SMD 0805)
S1  SW-DIP4  [DIP-8]
S2  SMD Tactile Switch  [SMD Tactile Switch]  (value not drawn)
S3  SMD Tactile Switch  [SMD Tactile Switch]  (value not drawn)
S4  SMD Tactile Switch  [SMD Tactile Switch]  (value not drawn)

### Blocks framed on the sheet
Motor ESC Connectors: Header3-Header6 J1-J4
FPGA Switches: R4 R5 S1-S4
FPGA LED's: LED1 LED2 R6 R7
Forward Ultrasonic Ranger: C9-C11 Module1

### Nets
+3.3V: C1.1(+) C2.2 C3.1(+) C4.1 C8.1 IC1.0(Vdd_IO) IC1.14(Vdd) IC1.15(Vdd) IC2.0(VDDIO) IC2.13(VDD) IC3.6(HOLD#) IC3.7(VCC) J1.1(C1) J2.1(C1) J3.1(C1) J4.1(C1) R1.2 R2.1 S1.1 S1.2 S1.3 S1.4 S2.1(COMMON) S3.1(COMMON) S4.1(COMMON)
+5.0V: C9.2 C10.1 C11.1(+) Module1.0(VDD)
GND: C2.1 C3.2(-) C4.2 C5.1 C7.2 C8.2 C9.1 C10.2 C11.2(-) Header3.3 Header4.3 Header5.3 Header6.3 IC1.7(GND) IC1.8(GND) IC1.9(GND) IC1.10(GND) IC1.11(GND) IC2.4(GND) IC2.7(GND) IC2.9(GND) IC2.11(GND) IC2.12(GND) IC2.14(GND) IC2.15(GND) IC3.3(GND) Module1.3(VSS) R3.2 R4.5(A) R4.6(B) R4.7(C) R4.8(D) R5.5(A) R5.6(B) R5.7(C) R6.2 R7.2
Accel_INT1: IC2.10(INT1)
Accel_INT2: IC2.8(INT2)
Accel_SA0: IC2.6(SA0)
Accel_SCL: IC2.3(SCL) R1.1  [also labelled FPGA_I2C_Clock]
Accel_SDA: IC2.5(SDA) R2.2  [also labelled FPGA_I2C_Data]
CONFSwitch_1: R4.4(D) S1.8
CONFSwitch_2: R4.3(C) S1.7
CONFSwitch_3: R4.2(B) S1.6
CONFSwitch_4: R4.1(A) S1.5
CONFSwitch_5: R5.3(C) S2.2(NO)
CONFSwitch_6: R5.2(B) S3.2(NO)
CONFSwitch_7: R5.1(A) S4.2(NO)
FPGA_SPI_/GyroCS: IC1.4(CS)  [also labelled Gyro_/CS]
FPGA_SPI_/SRAMCS: IC3.0(CS#)  [also labelled FPGASRAM_/CS]
FPGA_SPI_Clock: IC1.1(SPC) IC3.5(SCK)  [also labelled FPGASRAM_SCK, Gyro_SPC]
FPGA_SPI_DataIn: IC1.2(SDI) IC3.4(SI)  [also labelled FPGASRAM_SI, Gyro_SDI]
FPGA_SPI_DataOut: IC1.3(SDO) IC3.1(SO)  [also labelled FPGASRAM_SO, Gyro_SDO]
FPGASRAM_/WP: IC3.2(WP#/ACC)
FUltrasonic_EDGE: Module1.2(Edge)
FUltrasonic_TRIGGER: Module1.1(Trigger)
Gyro_DRDY: IC1.5(DRDY/INT2)
Gyro_INT1: IC1.6(INT1)
Motor_W1: Header3.1
Motor_W2: Header5.1
Motor_W3: Header6.1
Motor_W4: Header4.1
TLED_Orange1: LED1.1(A1) LED1.3(A2)  [project net P28]
TLED_Orange2: LED2.1(A1) LED2.3(A2)  [project net P30]
NetC1_2: C1.2(-) IC1.12(GND)
NetC5_2: C5.2 IC2.1(BYP)
NetC6_1: C6.1 C7.1 IC1.13(PLLFILT)
NetC6_2: C6.2 R3.1
NetHeader3_2: Header3.2 J1.2(C2)
NetHeader4_2: Header4.2 J3.2(C2)
NetHeader5_2: Header5.2 J2.2(C2)
NetHeader6_2: Header6.2 J4.2(C2)
NetLED1_2: LED1.2(K1) LED1.4(K2) R6.1
NetLED2_2: LED2.2(K1) LED2.4(K2) R7.1

Not connected (* = marked no-connect by the designer): IC2 2(NC)*; R5 4(D)* 8(D)*

### Notes on the sheet
- Gyroscope
- 10MHz SPI Interface
- Accelerometer
- 2.25MHz I2C Interface
- Data Bus Connections
- Serial SRAM
- 104/40MHz SPI Interface
- (in symbol HSMF-C157) G; O
- (in symbol L3G4200D) Three-Axis Gyroscope
- (in symbol MMA8452Q) 3-Axis Accelerometer
- (in symbol S25FL128P) 128MB SRAM

### Library data of the parts
C1 C3 C11 = SMD_Cap_Tantalum: Tantalum Capacitor - Case A
C2 C4-C9 = Cap: Capacitor
C10 = Cap Pol1: Polarized Capacitor (Radial); Published: 8-Jun-2000; LatestRevisionDate: 17-Jul-2002; LatestRevisionNote: Re-released for DXP Platform.; PackageReference: RB7.6-15; Publisher: Altium Limited; PackageDescription: Polarized Capacitor (Radial); 2 Leads
Header3-Header6 = Header 3H: Header, 3-Pin, Right Angle; LatestRevisionDate: 17-Jul-2002; LatestRevisionNote: Re-released for DXP Platform.; Publisher: Altium Limited
IC1 = L3G4200D: Three-Axis Digital Output MEMS Gyroscope; pin to pad: 0>1 1>2 2>3 3>4 4>5 5>6 6>7 7>8 8>9 9>10 10>11 11>12 12>13 13>14 14>15 15>16
IC2 = MMA8452Q: 3-Axis, 12-bit/8-bit Digital Accelerometer; pin to pad: 0>1 1>2 2>3 3>4 4>5 5>6 6>7 7>8 8>9 9>10 10>11 11>12 12>13 13>14 14>15 15>16
IC3 = S25FL128P: 128MB 104-MHz SPI Flash Memory; pin to pad: 0>1 1>2 2>3 3>4 4>5 5>6 6>7 7>8
J1-J4 = Jumper: Jumper Wire; Published: 24-Mar-1999; LatestRevisionDate: 17-Jul-2002; LatestRevisionNote: Re-released for DXP Platform.; PackageReference: RAD-0.2; Publisher: Altium Limited; PackageDescription: Radial Cap, Thru-Hole; 2 Leads; 0.2 in Pin Spacing
LED1 LED2 = HSMF-C157: Surface Mount Chip LED; pin to pad: 1>2 2>1; LuminousIntensity: 2.5mcd (Minimum).; LED_Colour: Orange & Green; PCB_Layout: Complies with manufacturer's recommendation.; Published: 11-Dec-2002; DatasheetVersion: 18-Apr-2002; PackageVersion: 18-Apr-2002; PackageReference: 3.2X2.7X1.1; Publisher: Altium Limited; PackageDescription: SM LED, Bi-Colour; 4 Flat Leads; Body 3.2 x 2.7 x 1.1 mm (LxWxH); ComponentLink1Description: Manufacturer Link; ComponentLink1URL: http://www.avagotech.com/; ComponentLink2Description: Datasheet; ComponentLink2URL: http://cp.literature.agilent.com/litweb/pdf/5988-6268EN.pdf
Module1 = HC-SR04 Ultrasonic Module: pin to pad: 0>1 1>2 2>3 3>4
R1-R3 R6 R7 = Res2: Resistor
R4 R5 = SMD Resistor Array: 4-Count Resistor Array; pin to pad: 5>8 6>7 7>6 8>5
S1 = SW-DIP4: DIP Switch; Published: 24-Mar-1999; LatestRevisionDate: 17-Jul-2002; LatestRevisionNote: Re-released for DXP Platform.; PackageReference: DIP-8; Publisher: Altium Limited
S2-S4 = SW-SPST: Single-Pole, Single-Throw Switch; Published: 24-Mar-1999; LatestRevisionDate: 17-Jul-2002; LatestRevisionNote: Re-released for DXP Platform.; PackageReference: SPST-2; Publisher: Altium Limited; PackageDescription: Switch; 2 Leads

## Sheet Power.SchDoc: Flight Control Board Power Regulation System
size A; Date: Spring 2012; Author: David Greene; CompanyName: Team Sky Lights; DrawnBy: David Greene; Engineer: D'Acunto & Greene; Organization: Team Sky Lights; DocumentNumber: 1; Revision: 1.0; SheetNumber: 1; SheetTotal: 8; PageSetup: Record=PageOptions|CenterHorizontal=True|CenterVertical=True|PrintScale=1.12|XCorrection=1.00|YCorrection=1.00|PrintKind=0|BorderSize=5000000|LeftOffset=0|BottomOffset=0|Orientation=2|PaperLength=1000|PaperWidth=1000|Scale=100|PaperSource=7|PrintQuality=-4|MediaType=1|DitherType=10|PaperKind=Letter|PrintScaleMode=1; DocumentName: Flight Control Board Power Regulation System; ProjectName: The Ad-Flier!
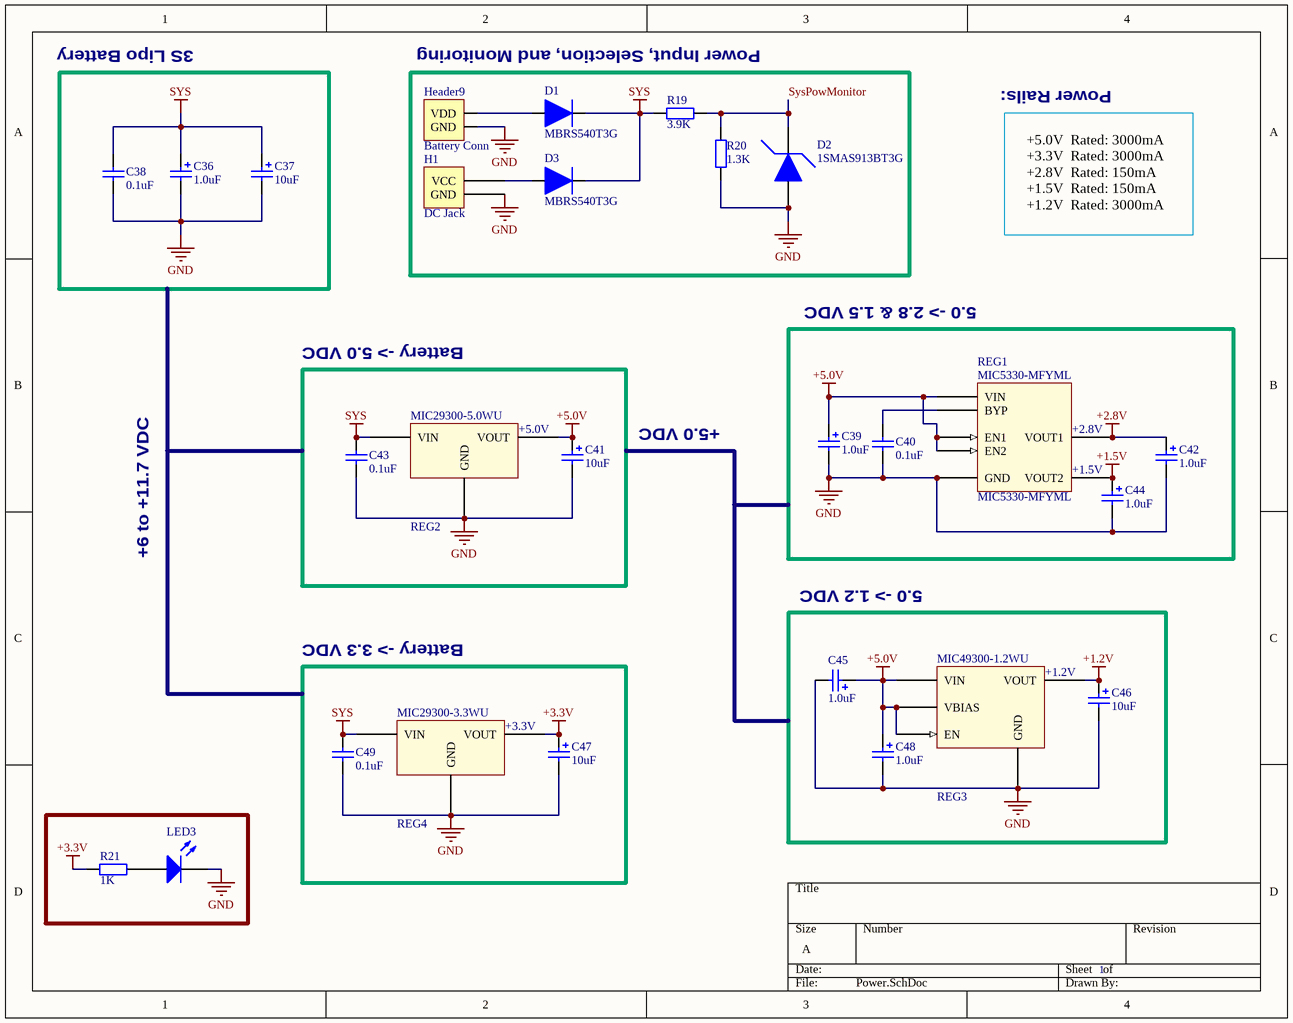
[diagram p6: Power.SchDoc]

### Parts
C36  value 1.0uF  [CAPPR2-5x5]  (hidden comment: 1.0uF Electrolitic)
C37  value 10uF  [CAPPR2-5x5]  (hidden comment: 10uF Electrolitic)
C38  value 0.1uF  [CAPRD5-6.5x4.5]  (hidden comment: 0.1uF Ceramic)
C39  value 1.0uF  [Capacitor - Tantalum Case A]  (hidden comment: 1.0uF Low-ESR Tantalum CaseA)
C40  value 0.1uF  [SMD 1206]  (hidden comment: 0.1uF SMD 1206)
C41  value 10uF  [Capacitor - Tantalum Case A]  (hidden comment: 10uF Low-ESR Tantalum CaseA)
C42  value 1.0uF  [Capacitor - Tantalum Case A]  (hidden comment: 1.0uF Low-ESR Tantalum CaseA)
C43  value 0.1uF  [SMD 1206]  (hidden comment: 0.1uF SMD 1206)
C44  value 1.0uF  [Capacitor - Tantalum Case A]  (hidden comment: 1.0uF Low-ESR Tantalum CaseA)
C45  value 1.0uF  [Capacitor - Tantalum Case A]  (hidden comment: 1.0uF Low-ESR Tantalum CaseA)
C46  value 10uF  [Capacitor - Tantalum Case A]  (hidden comment: 10uF Low-ESR Tantalum CaseA)
C47  value 10uF  [Capacitor - Tantalum Case A]  (hidden comment: 10uF Low-ESR Tantalum CaseA)
C48  value 1.0uF  [Capacitor - Tantalum Case A]  (hidden comment: 1.0uF Low-ESR Tantalum CaseA)
C49  value 0.1uF  [SMD 1206]  (hidden comment: 0.1uF SMD 1206)
D1  MBRS540T3G  [MBRS540T3G]
D2  1SMAS913BT3G  [1SMA5913BT3G]
D3  MBRS540T3G  [MBRS540T3G]
H1  DC Jack  [DC Power Jack]
Header9  Battery Conn  [PC Wire Connector]
LED3  LED PLCC-4  [PLCC-4 LED]  (value not drawn)
R19  value 3.9K  [RES12.2-8.5X3.3]  (hidden comment: 3.9K Radial)
R20  value 1.3K  [RES12.2-8.5X3.3]  (hidden comment: 1.3K Radial)
R21  value 1K  [SMD 0805]  (hidden comment: 1K SMD 0805)
REG1  MIC5330-MFYML  [MIC5330-MFYML TR]
REG2  MIC29300-5.0WU  [TO-263 D2PACK]  (value not drawn)
REG3  MIC49300-1.2WR  [MIC49300-1.2WR SPACK-5]  (value not drawn)
REG4  MIC29300-3.3WU  [TO-263 D2PACK]  (value not drawn)

### Nets
+1.2V: C46.1(+) REG3.4(VOUT)
+1.5V: C44.1(+) REG1.6(VOUT2)
+2.8V: C42.1(+) REG1.7(VOUT1)
+3.3V: C47.1(+) R21.2 REG4.2(VOUT)
+5.0V: C39.1(+) C41.1(+) C45.1(+) C48.1(+) REG1.0(VIN) REG1.3(EN2) REG1.4(EN1) REG2.2(VOUT) REG3.0(EN) REG3.1(VBIAS) REG3.3(VIN)
GND: C36.2 C37.2 C38.1 C39.2(-) C40.1 C41.2(-) C42.2(-) C43.2 C44.2(-) C45.2(-) C46.2(-) C47.2(-) C48.2(-) C49.1 D2.0(In) H1.GND Header9.R(GND) LED3.2(K) R20.1 REG1.1(GND) REG2.1(GND) REG3.2(GND) REG4.1(GND)
SYS: C36.1 C37.1 C38.2 C43.1 C49.2 D1.1(Out) D3.1(Out) R19.2 REG2.0(VIN) REG4.0(VIN)
SysPowMonitor: D2.1(Out) R19.1 R20.2
NetC40_2: C40.2 REG1.2(BYP)
NetD1_0: D1.0(In) Header9.L(VDD)
NetD3_0: D3.0(In) H1.VCC
NetLED3_1: LED3.1(A) R21.1

Not connected (* = marked no-connect by the designer): H1 NC; REG1 5(NC)

### Notes on the sheet
- 3S Lipo Battery
- Power Input, Selection, and Monitoring
- Power Rails:
- +5.0V  Rated: 3000mA
  +3.3V  Rated: 3000mA
  +2.8V  Rated: 150mA
  +1.5V  Rated: 150mA
  +1.2V  Rated: 3000mA
- 5.0 -> 2.8 & 1.5 VDC
- Battery -> 5.0 VDC
- +5.0 VDC
- +6 to +11.7 VDC
- Battery -> 3.3 VDC
- 5.0 -> 1.2 VDC
- 1
- (in symbol MIC5330-MFYML) +2.8V; +1.5V
- (in symbol MIC29300-3.3WU) +3.3V
- (in symbol MIC29300-5.0WU) +5.0V
- (in symbol MIC49300-1.2WR) MIC49300-1.2WU; +1.2V

### Library data of the parts
C36 C37 = Cap Pol1: Polarized Capacitor (Radial); Published: 8-Jun-2000; LatestRevisionDate: 17-Jul-2002; LatestRevisionNote: Re-released for DXP Platform.; PackageReference: RB7.6-15; Publisher: Altium Limited; PackageDescription: Polarized Capacitor (Radial); 2 Leads
C38 C40 C43 C49 = Cap: Capacitor
C39 C41 C42 C44-C48 = SMD_Cap_Tantalum: Tantalum Capacitor - Case A
D1 D3 = MBRS540T3G: 40V 5A Scottky Diode; pin to pad: 0>A 1>K
D2 = 1SMAS913BT3G: 3.3V 1.5W Zener Diode; pin to pad: 0>A 1>K
H1 = DC Jack: DC Power Jack; pin to pad: GND>OUT VCC>IN
Header9 = PC Wire Connector
LED3 = SMD LED: Surface Mount Chip LED; pin to pad: 1>2 2>1
R19-R21 = Res2: Resistor
REG1 = MIC5330-MFYML: Dual 300mA LDO (Lead Free Compliant); pin to pad: 0>1 1>2 2>3 3>4 4>5 5>6 6>7 7>8
REG2 = MIC29300-5.0WU: 3.0A LDO Fixed Volt.(ROHS Compliant); pin to pad: 0>1 1>2 2>3
REG3 = MIC49300-1.2WR: Dual Supply, LV 3.0A LDO(ROHS Compliant); pin to pad: 0>1 1>2 2>3 3>4 4>5
REG4 = MIC29300-3.3WU: 3.0A LDO Fixed Volt.(ROHS Compliant); pin to pad: 0>1 1>2 2>3

## Nets that join several sheets
+1.2V: FPGA_Core (11 pins), FPGA_Clocks (7 pins), Power (C46.1 REG3.4)
+1.5V: FPGA_Core (Header7.4), Power (C44.1 REG1.6)
+2.8V: FPGA_Core (FPGA1.77 FPGA1.95 FPGA1.102 Header7.6), FPGA_Clocks (C57.1 C61.1 C66.1 C69.1), Power (C42.1 REG1.7)
+3.3V: Navigator_Core (15 pins), Navigator_Connectors (C23.2 Header_8.2), Navigator_Components (29 pins), FPGA_Core (10 pins), FPGA_Clocks (23 pins), FPGA_Components (25 pins), Power (C47.1 R21.2 REG4.2)
+5.0V: FPGA_Core (Header7.10), FPGA_Clocks (7 pins), FPGA_Components (C9.2 C10.1 C11.1 Module1.0), Power (11 pins)
GND: Navigator_Core (19 pins), Navigator_Connectors (10 pins), Navigator_Components (22 pins), FPGA_Core (30 pins), FPGA_Clocks (37 pins), FPGA_Components (37 pins), Power (23 pins)
Accel_INT1: FPGA_Core (FPGA1.55), FPGA_Components (IC2.10)
Accel_INT2: FPGA_Core (FPGA1.57), FPGA_Components (IC2.8)
Accel_SA0: FPGA_Core (FPGA1.53), FPGA_Components (IC2.6)
Accel_SCL: FPGA_Core (FPGA1.43), FPGA_Components (IC2.3 R1.1)
Accel_SDA: FPGA_Core (FPGA1.44), FPGA_Components (IC2.5 R2.2)
ASDO: FPGA_Core (FPGA1.1), FPGA_Clocks (IC8.4 JEPC.9)
Barometer_/CS: Navigator_Core (IC7.76), Navigator_Components (IC5.4)
Barometer_/SHDN: Navigator_Core (IC7.38), Navigator_Components (IC5.3)
Barometer_DIN: Navigator_Core (IC7.72), Navigator_Connectors (Debug1.2), Navigator_Components (Header1.21 IC4.4 IC5.6 Module3.2)
Barometer_DOUT: Navigator_Core (IC7.9), Navigator_Connectors (Debug1.3), Navigator_Components (Header1.22 IC4.1 IC5.5 Module3.6)
Barometer_SCLK: Navigator_Core (IC7.70), Navigator_Connectors (Debug1.4), Navigator_Components (Header1.20 IC4.5 IC5.7 Module3.4)
CONFSwitch_1: FPGA_Core (FPGA1.3), FPGA_Components (R4.4 S1.8)
CONFSwitch_2: FPGA_Core (FPGA1.4), FPGA_Components (R4.3 S1.7)
CONFSwitch_3: FPGA_Core (FPGA1.7), FPGA_Components (R4.2 S1.6)
CONFSwitch_4: FPGA_Core (FPGA1.8), FPGA_Components (R4.1 S1.5)
CONFSwitch_5: FPGA_Core (FPGA1.9), FPGA_Components (R5.3 S2.2)
CONFSwitch_6: FPGA_Core (FPGA1.24), FPGA_Components (R5.2 S3.2)
CONFSwitch_7: FPGA_Core (FPGA1.25), FPGA_Components (R5.1 S4.2)
DS1085_SCL: Navigator_Core (IC7.66), Navigator_Connectors (Debug2.3), Navigator_Components (Header2.3 IC6.0 R11.1), FPGA_Clocks (IC9.7 R29.5)
DS1085_SDA: Navigator_Core (IC7.67), Navigator_Connectors (Debug2.2), Navigator_Components (Header2.2 IC6.15 R12.1), FPGA_Clocks (IC9.6 R29.6)
FPGA_A-/D: Navigator_Core (IC7.18), FPGA_Core (FPGA1.122)
FPGA_D0: Navigator_Core (IC7.93), FPGA_Core (FPGA1.112)
FPGA_D1: Navigator_Core (IC7.94), FPGA_Core (FPGA1.113)
FPGA_D2: Navigator_Core (IC7.98), FPGA_Core (FPGA1.114)
FPGA_D3: Navigator_Core (IC7.99), FPGA_Core (FPGA1.115)
FPGA_D4: Navigator_Core (IC7.100), FPGA_Core (FPGA1.118)
FPGA_D5: Navigator_Core (IC7.3), FPGA_Core (FPGA1.119)
FPGA_D6: Navigator_Core (IC7.4), FPGA_Core (FPGA1.120)
FPGA_D7: Navigator_Core (IC7.5), FPGA_Core (FPGA1.121)
FPGA_OK-IN: Navigator_Core (IC7.88), FPGA_Core (FPGA1.129)
FPGA_OK-OUT: Navigator_Core (IC7.87), FPGA_Core (FPGA1.126)
FPGA_R-/W: Navigator_Core (IC7.19), FPGA_Core (FPGA1.125)
FPGA_SPI_/GyroCS: FPGA_Core (FPGA1.45), FPGA_Components (IC1.4)
FPGA_SPI_/SRAMCS: FPGA_Core (FPGA1.51), FPGA_Components (IC3.0)
FPGA_SPI_Clock: FPGA_Core (FPGA1.40), FPGA_Components (IC1.1 IC3.5)
FPGA_SPI_DataIn: FPGA_Core (FPGA1.41), FPGA_Components (IC1.2 IC3.4)
FPGA_SPI_DataOut: FPGA_Core (FPGA1.42), FPGA_Components (IC1.3 IC3.1)
FPGASRAM_/WP: FPGA_Core (FPGA1.52), FPGA_Components (IC3.2)
FUltrasonic_EDGE: FPGA_Core (FPGA1.32), FPGA_Components (Module1.2)
FUltrasonic_TRIGGER: FPGA_Core (FPGA1.31), FPGA_Components (Module1.1)
GPS_PPS: Navigator_Core (IC7.59), Navigator_Components (Module2.12)
GPS_RXA: Navigator_Core (IC7.39), Navigator_Connectors (Debug6.3), Navigator_Components (Module2.14)
GPS_RXB: Navigator_Core (IC7.50), Navigator_Connectors (Debug5.3), Navigator_Components (Module2.13)
GPS_TXA: Navigator_Core (IC7.40), Navigator_Connectors (Debug6.2), Navigator_Components (Module2.16)
GPS_TXB: Navigator_Core (IC7.49), Navigator_Connectors (Debug5.2), Navigator_Components (Module2.17)
GPS_XRST: Navigator_Core (IC7.61), Navigator_Components (Module2.6 R8.2)
GPS_XSTBY: Navigator_Core (IC7.60), Navigator_Components (Module2.9 R9.2)
Gyro_DRDY: FPGA_Core (FPGA1.47), FPGA_Components (IC1.5)
Gyro_INT1: FPGA_Core (FPGA1.48), FPGA_Components (IC1.6)
Humidity_I/O: Navigator_Core (IC7.29), Navigator_Components (Module5.1 R10.1)
ICSP_MCLR: Navigator_Core (R18.2), Navigator_Connectors (Header_8.1)
ICSP_PGC: Navigator_Core (IC7.24), Navigator_Connectors (R15.2)
ICSP_PGD: Navigator_Core (IC7.25), Navigator_Connectors (R14.2)
MagNet_DRDY: Navigator_Core (IC7.17), Navigator_Components (IC6.14)
Motor_W1: FPGA_Core (FPGA1.141), FPGA_Components (Header3.1)
Motor_W2: FPGA_Core (FPGA1.142), FPGA_Components (Header5.1)
Motor_W3: FPGA_Core (FPGA1.143), FPGA_Components (Header6.1)
Motor_W4: FPGA_Core (FPGA1.144), FPGA_Components (Header4.1)
nCSO: FPGA_Core (FPGA1.2), FPGA_Clocks (IC8.0 JEPC.8)
P28: FPGA_Core (FPGA1.28), FPGA_Components (LED1.1 LED1.3)
P30: FPGA_Core (FPGA1.30), FPGA_Components (LED2.1 LED2.3)
P132: Navigator_Core (IC7.10), Navigator_Connectors (Debug4.4), FPGA_Core (FPGA1.132)
P133: Navigator_Core (IC7.12), Navigator_Connectors (Debug4.2), FPGA_Core (FPGA1.133)
P134: Navigator_Core (IC7.11), Navigator_Connectors (Debug4.3), FPGA_Core (FPGA1.134)
P135: Navigator_Core (IC7.81), FPGA_Core (FPGA1.135)
PIC_Accel_INT1: Navigator_Core (IC7.69), Navigator_Components (Header2.5)
PIC_Accel_INT2: Navigator_Core (IC7.68), Navigator_Components (Header2.4)
PIC_Gyro_/CS: Navigator_Core (IC7.82), Navigator_Components (Header1.19)
PIC_Gyro_DRDY: Navigator_Core (IC7.83), Navigator_Components (Header1.15)
PIC_Gyro_INT1: Navigator_Core (IC7.84), Navigator_Components (Header1.23)
PIC_SRAM_/CS: Navigator_Core (IC7.78), Navigator_Components (IC4.0)
PIC_SRAM_/WP: Navigator_Core (IC7.58), Navigator_Components (IC4.2)
PIC_UART1_/CTS: Navigator_Core (IC7.47), Navigator_Components (Module4.15)
PIC_UART1_/RTS: Navigator_Core (IC7.48), Navigator_Components (Module4.11)
PIC_UART1_RX: Navigator_Core (IC7.52), Navigator_Connectors (Debug3.2), Navigator_Components (Module4.1)
PIC_UART1_TX: Navigator_Core (IC7.53), Navigator_Connectors (Debug3.3), Navigator_Components (Module4.2)
SysPowMonitor: Navigator_Core (IC7.23), Power (D2.1 R19.1 R20.2)
USB_PIC_N: Navigator_Core (IC7.56), Navigator_Connectors (Module6.3)
USB_PIC_P: Navigator_Core (IC7.57), Navigator_Connectors (Module6.2)
uSD_/CS: Navigator_Core (IC7.77), Navigator_Components (Module3.1)
VBUS: Navigator_Core (IC7.54), Navigator_Connectors (R13.6)
XBEE_/DTR: Navigator_Core (IC7.92), Navigator_Components (Module4.8)
XBEE_/Reset: Navigator_Core (IC7.28), Navigator_Components (Module4.4)
XBEE_Associate: Navigator_Core (IC7.91), Navigator_Components (Module4.14)